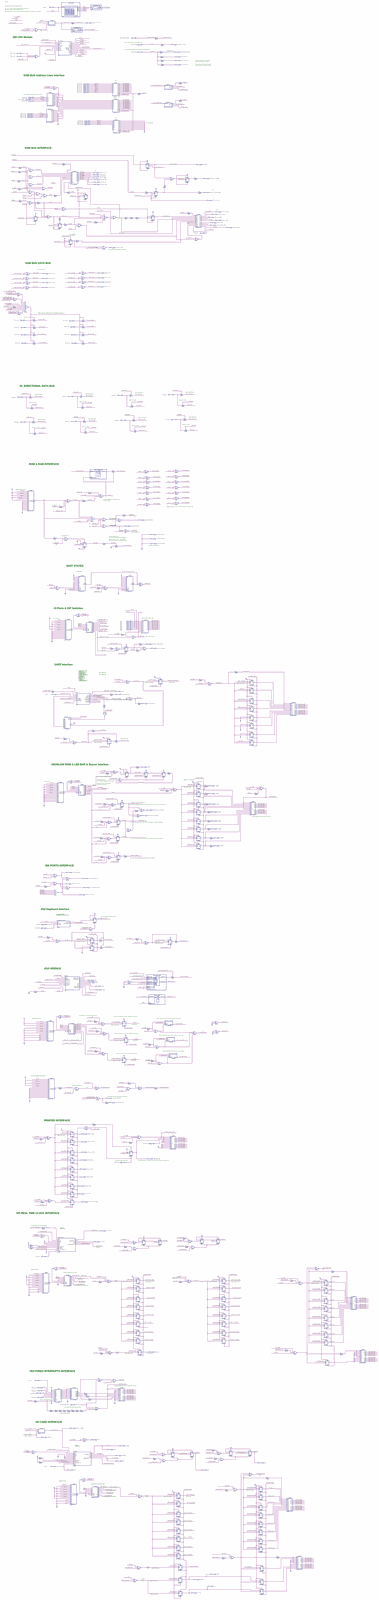
[diagram p0: schematic sheet, whole]
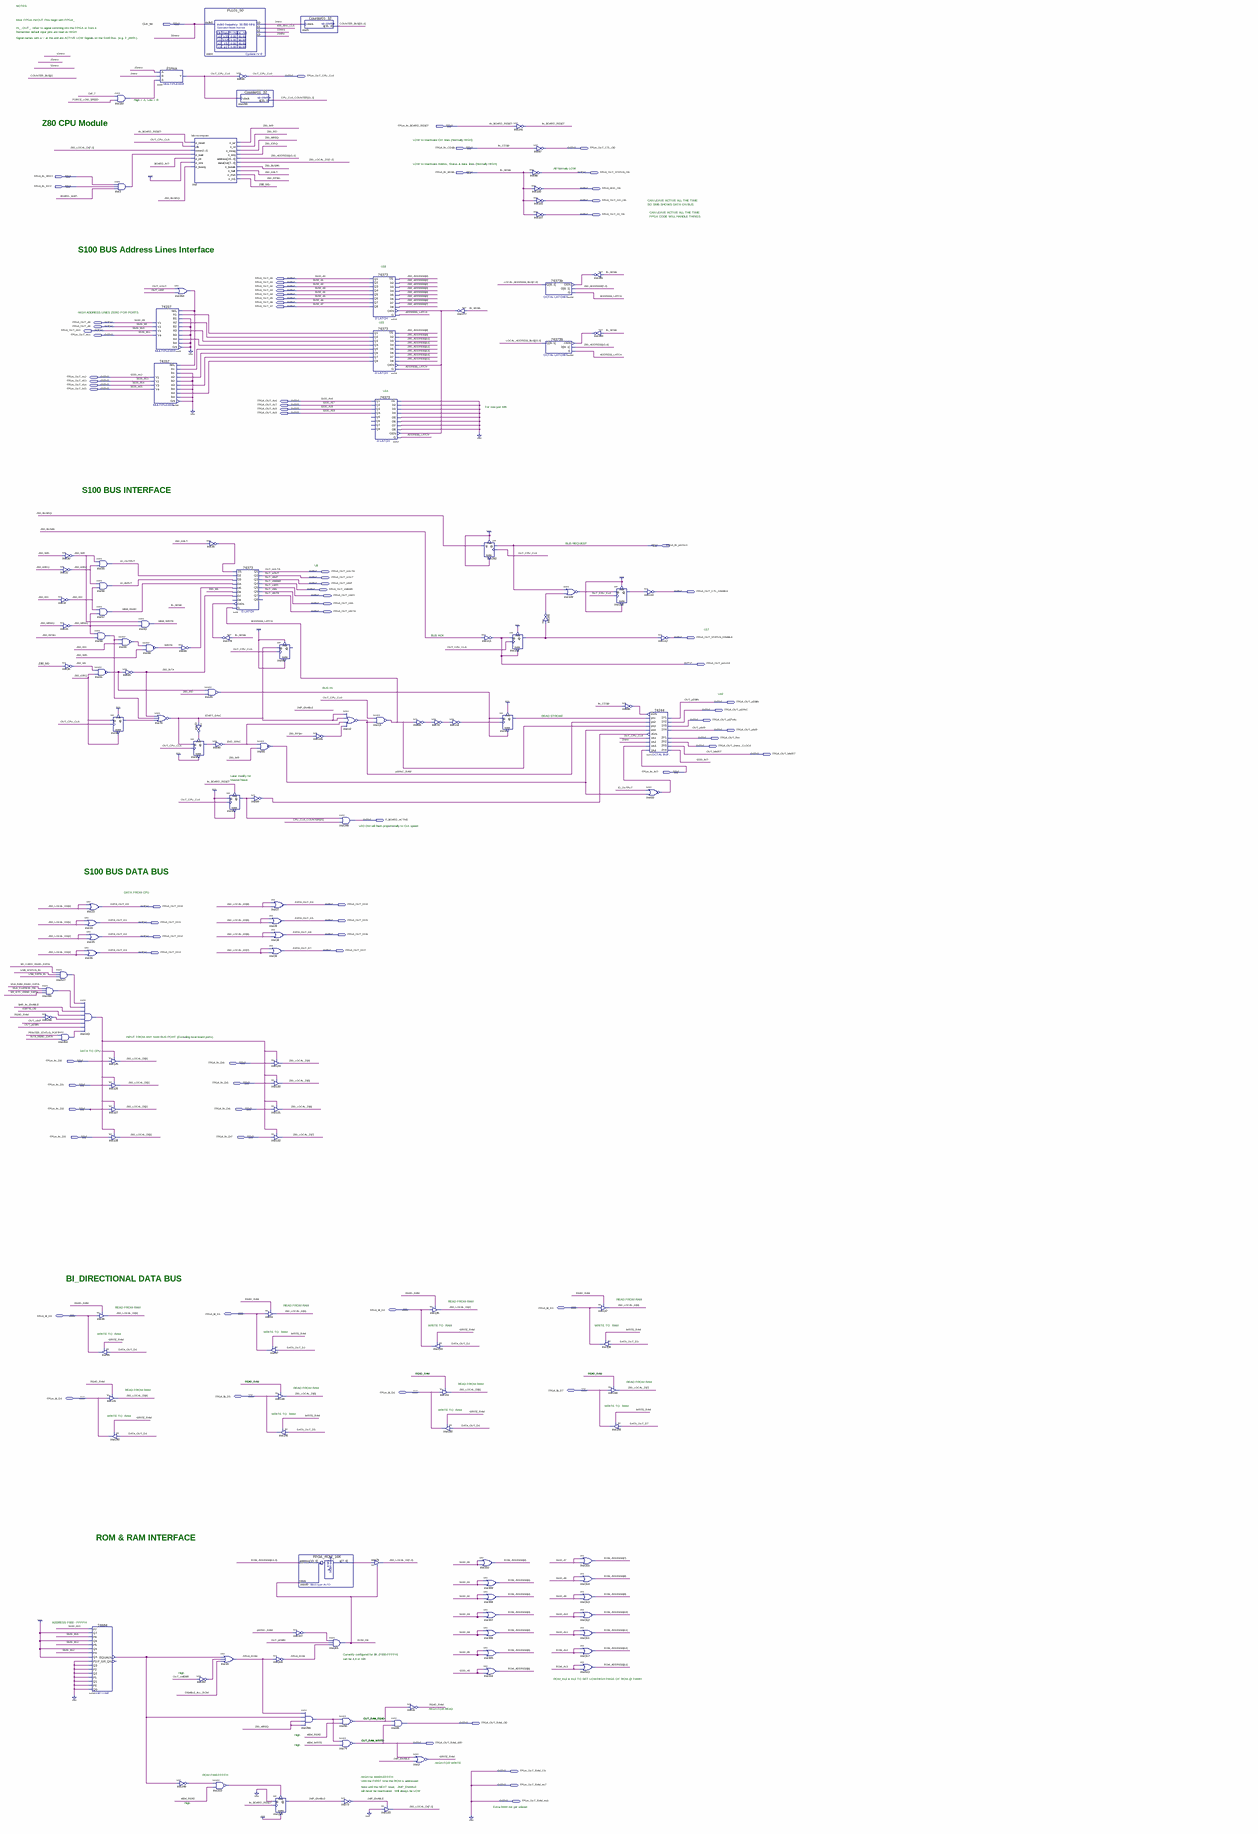
[diagram p1: schematic sheet, upper part]
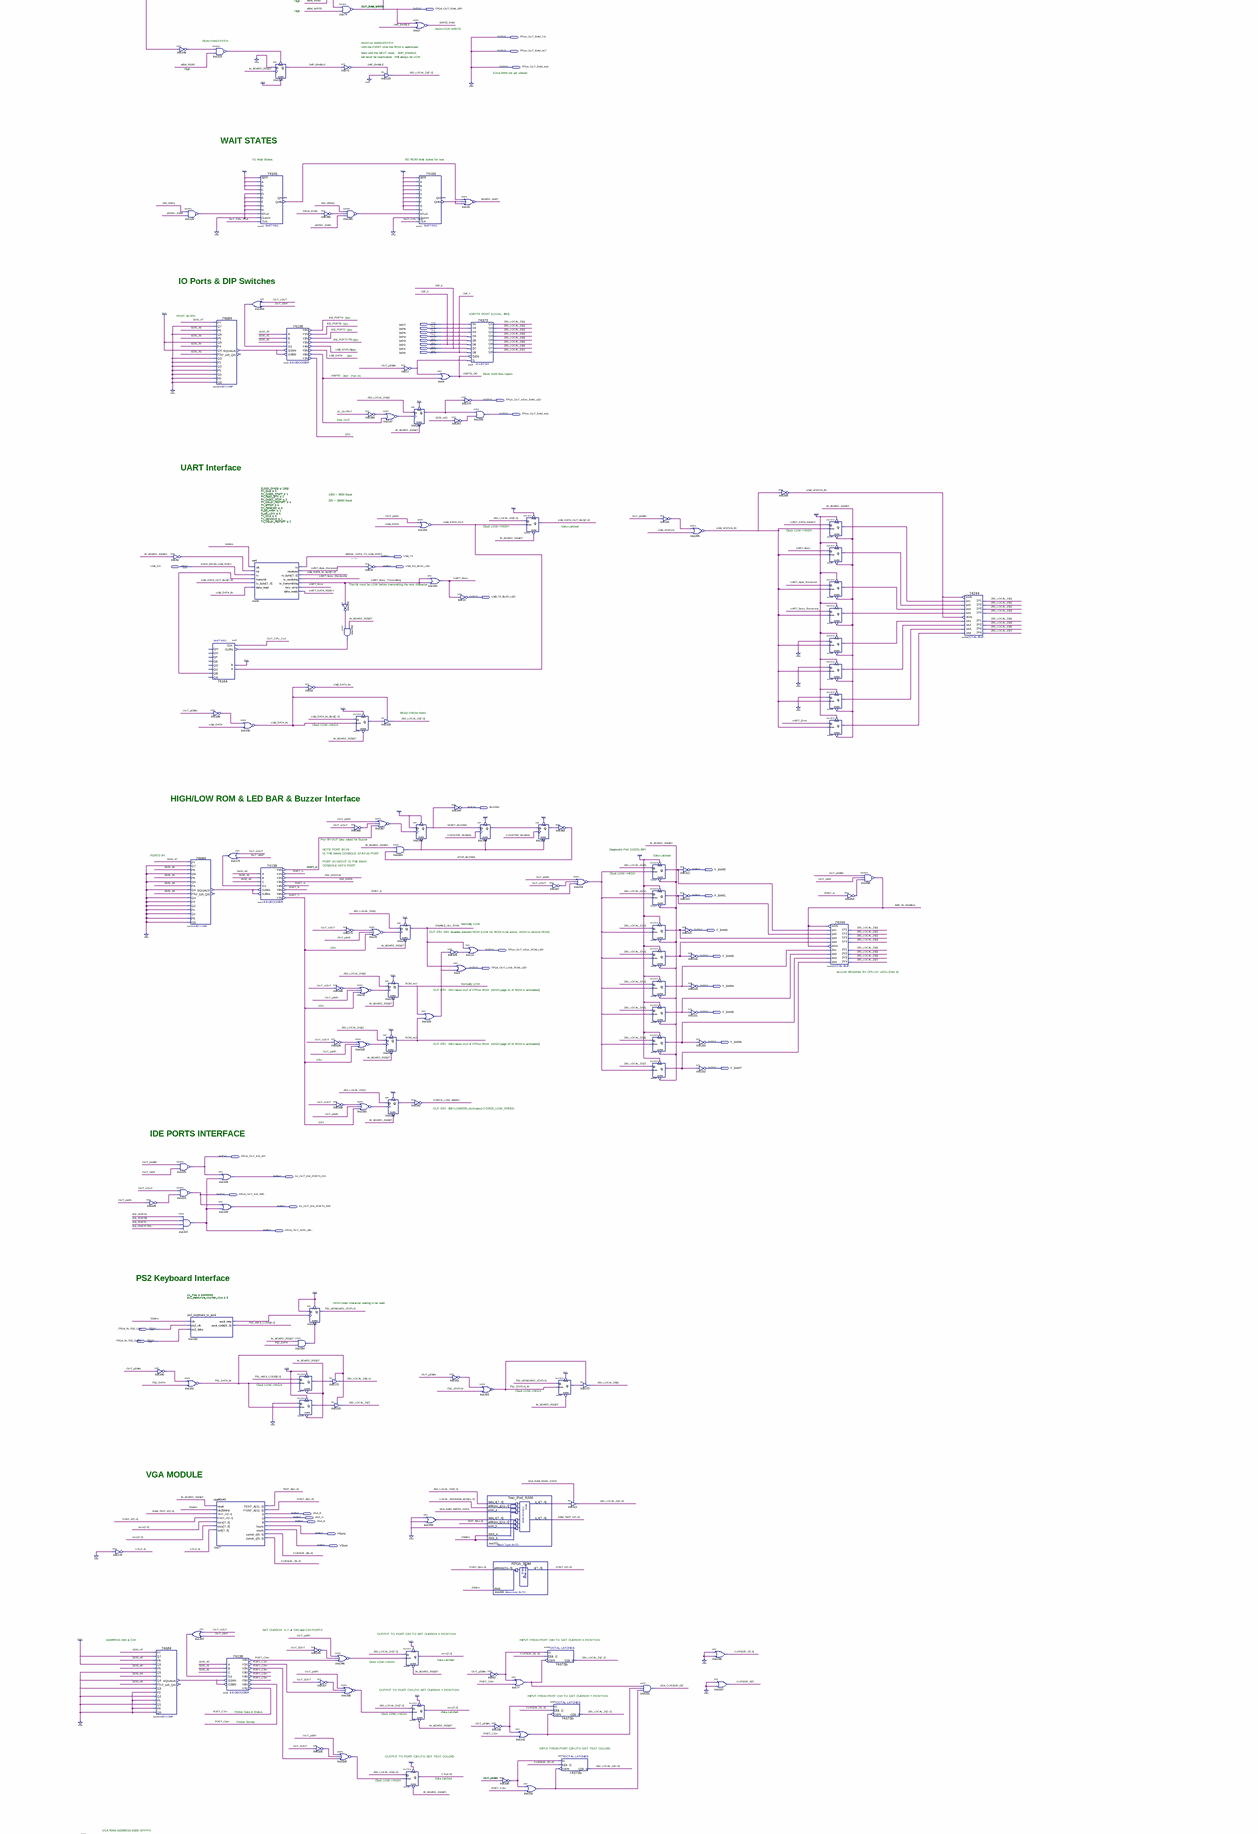
[diagram p2: schematic sheet, middle part]
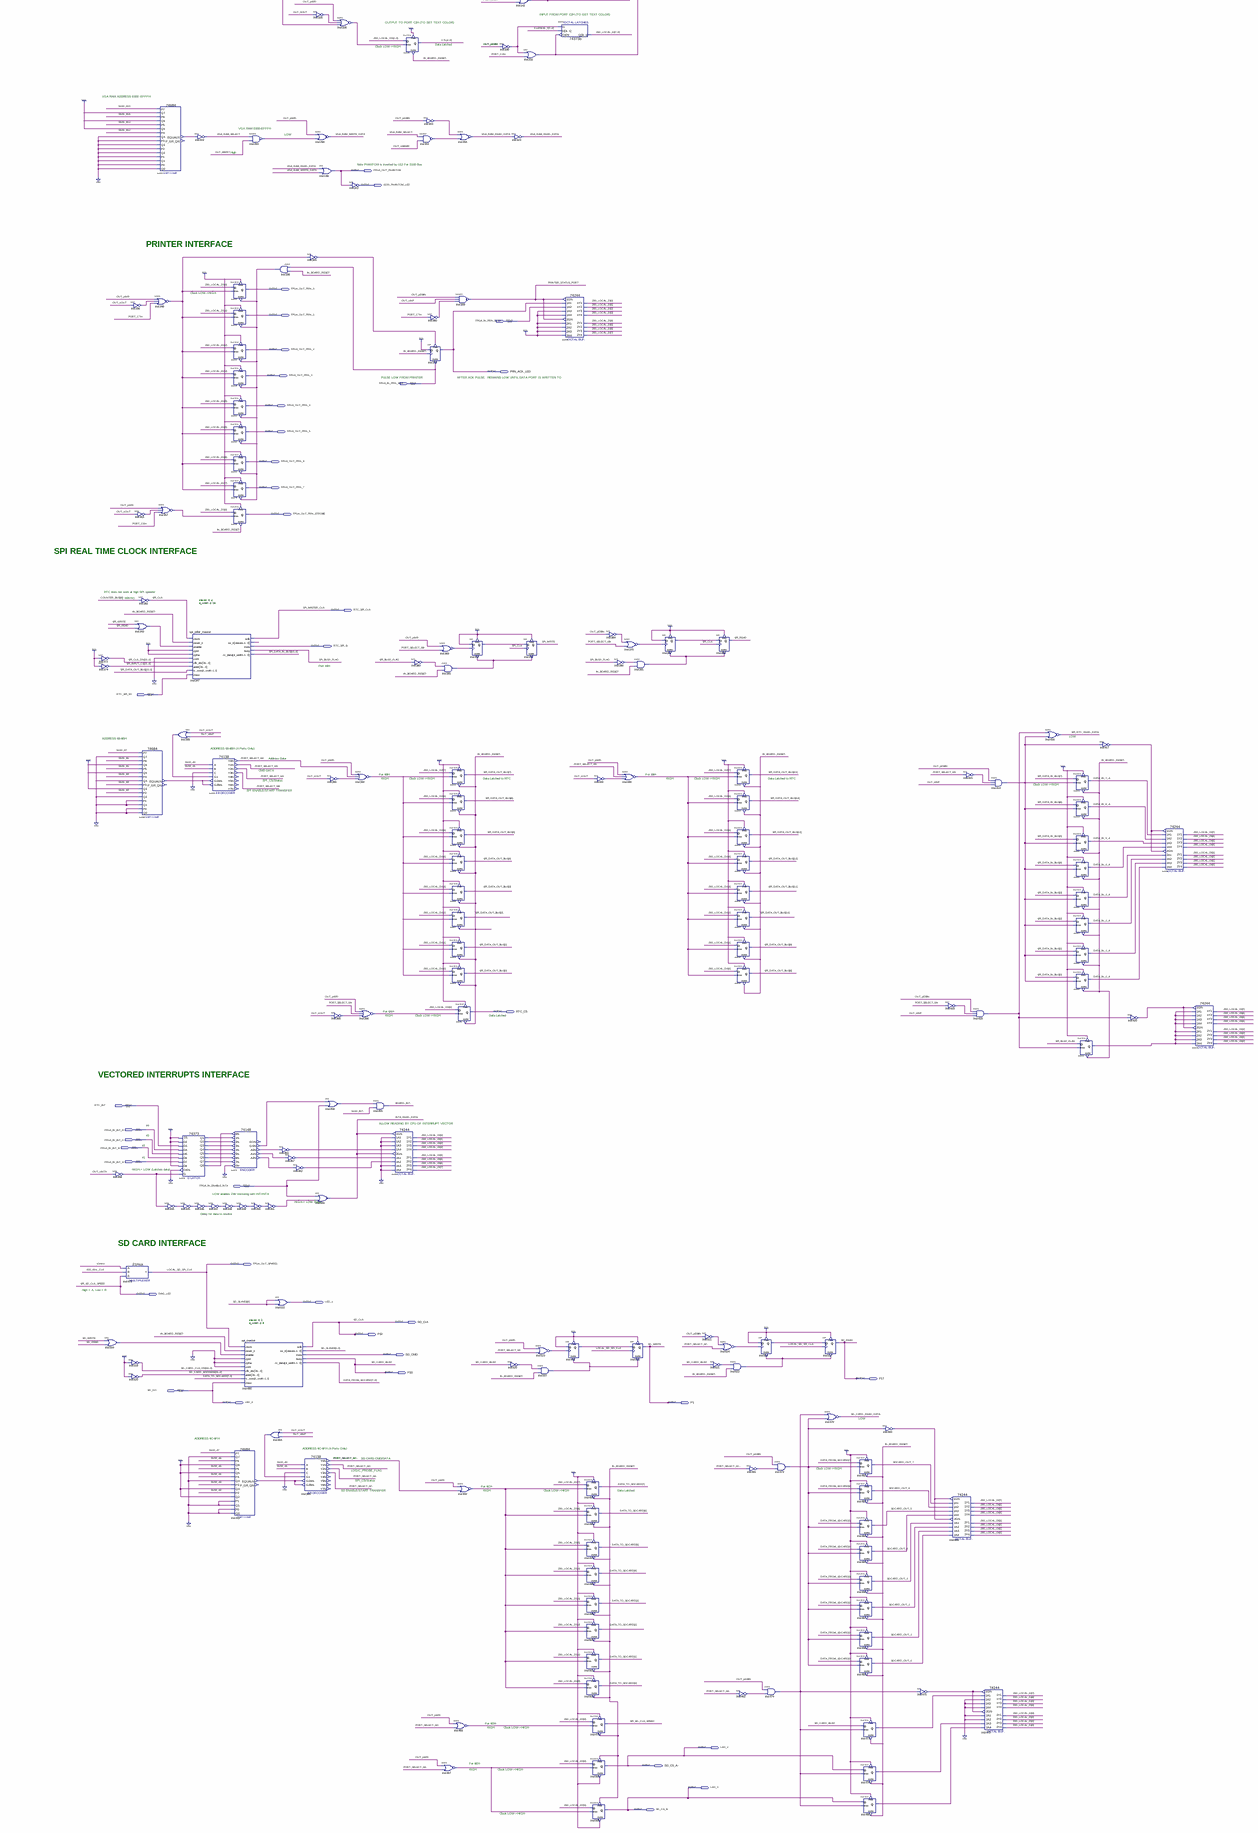
[diagram p3: schematic sheet, lower part]
// Quartus schematic Z80_FPGA.bdf as structural Verilog: 446 symbols, 157 pins
module Z80_FPGA (
  input  CLK_50,
  input  \FPGA_IN_BOARD_RESET- ,
  input  \FPGA_IN_CDSB- ,
  input  \FPGA_IN_SDSB- ,
  input  FPGA_IN_XRDY,
  input  FPGA_IN_RDY,
  input  \FPGA_IN_pHOLD- ,
  input  \FPGA_IN_INT- ,
  input  FPGA_IN_DI0,
  input  FPGA_IN_DI4,
  input  FPGA_IN_DI5,
  input  FPGA_IN_DI1,
  input  FPGA_IN_DI2,
  input  FPGA_IN_DI6,
  input  FPGA_IN_DI3,
  input  FPGA_IN_DI7,
  input  DIP7,
  input  DIP6,
  input  DIP5,
  input  DIP4,
  input  DIP3,
  input  DIP2,
  input  DIP1,
  input  DIP0,
  input  USB_RX,
  input  FPGA_IN_PS2_CLK,
  input  FPGA_IN_PS2_DATA,
  input  FPGA_IN_PRN_BUSY,
  input  FPGA_IN_PRN_ACK,
  input  RTC_SPI_SO,
  input  RTC_INT,
  input  \FPGA_IN_INT_D- ,
  input  \FPGA_IN_INT_C- ,
  input  \FPGA_IN_INT_B- ,
  input  \FPGA_IN_INT_A- ,
  input  FPGA_IN_ENABLE_INTA,
  input  SD_DO,
  inout  FPGA_BI_D3,
  inout  FPGA_BI_D2,
  inout  FPGA_BI_D1,
  inout  FPGA_BI_D0,
  inout  FPGA_BI_D7,
  inout  FPGA_BI_D6,
  inout  FPGA_BI_D5,
  inout  FPGA_BI_D4,
  output FPGA_OUT_CPU_CLK,
  output \FPGA_OUT_CTL_OE- ,
  output \FPGA_OUT_STATUS_OE- ,
  output \FPGA_ADD_OE- ,
  output \FPGA_OUT_DO_OE- ,
  output \FPGA_OUT_DI_OE- ,
  output FPGA_OUT_A0,
  output FPGA_OUT_A1,
  output FPGA_OUT_A2,
  output FPGA_OUT_A3,
  output FPGA_OUT_A4,
  output FPGA_OUT_A5,
  output FPGA_OUT_A6,
  output FPGA_OUT_A7,
  output FPGA_OUT_A8,
  output FPGA_OUT_A9,
  output FPGA_OUT_A10,
  output FPGA_OUT_A11,
  output FPGA_OUT_A12,
  output FPGA_OUT_A13,
  output FPGA_OUT_A14,
  output FPGA_OUT_A15,
  output FPGA_OUT_A16,
  output FPGA_OUT_A17,
  output FPGA_OUT_A18,
  output FPGA_OUT_A19,
  output FPGA_OUT_sHLTA,
  output FPGA_OUT_sOUT,
  output FPGA_OUT_sINP,
  output FPGA_OUT_sMEMR,
  output FPGA_OUT_CTL_DISABLE,
  output \FPGA_OUT_sWO- ,
  output FPGA_OUT_sM1,
  output FPGA_OUT_sINTA,
  output FPGA_OUT_STATUS_DISABLE,
  output FPGA_OUT_pHLDA,
  output FPGA_OUT_pDBIN,
  output FPGA_OUT_pSYNC,
  output \FPGA_OUT_pSTVAL- ,
  output \FPGA_OUT_pWR- ,
  output FPGA_OUT_PHI,
  output FPGA_OUT_2mHz_CLOCK,
  output FPGA_OUT_MWRT,
  output \F_BOARD_ACTIVE- ,
  output FPGA_OUT_DO4,
  output FPGA_OUT_DO0,
  output FPGA_OUT_DO5,
  output FPGA_OUT_DO1,
  output FPGA_OUT_DO6,
  output FPGA_OUT_DO2,
  output FPGA_OUT_DO7,
  output FPGA_OUT_DO3,
  output \FPGA_OUT_RAM_OE- ,
  output \FPGA_OUT_RAM_WR- ,
  output \FPGA_OUT_RAM_CS- ,
  output FPGA_OUT_RAM_A17,
  output FPGA_OUT_RAM_A18,
  output \FPGA_OUT_HIGH_RAM_LED- ,
  output FPGA_OUT_RAM_A16,
  output USB_TX,
  output USB_RX_BUSY_LED,
  output USB_TX_BUSY_LED,
  output BUZZER,
  output F_BAR0,
  output F_BAR1,
  output F_BAR2,
  output \FPGA_OUT_HIGH_ROM_LED- ,
  output F_BAR3,
  output \FPGA_OUT_LOW_ROM_LED- ,
  output F_BAR4,
  output F_BAR5,
  output F_BAR6,
  output F_BAR7,
  output \FPGA_OUT_IDE_RD- ,
  output \5V_OUT_IDE_PORTS_RD- ,
  output \FPGA_OUT_IDE_WR- ,
  output \5V_OUT_IDE_PORTS_WR- ,
  output \FPGA_OUT_8255_SEL- ,
  output VGA_R,
  output VGA_G,
  output VGA_B,
  output HSync,
  output VSync,
  output FPGA_OUT_PHANTOM,
  output S100_PHANTOM_LED,
  output FPGA_OUT_PRN_0,
  output FPGA_OUT_PRN_1,
  output FPGA_OUT_PRN_2,
  output PRN_ACK_LED,
  output FPGA_OUT_PRN_3,
  output FPGA_OUT_PRN_4,
  output FPGA_OUT_PRN_5,
  output FPGA_OUT_PRN_6,
  output FPGA_OUT_PRN_7,
  output FPGA_OUT_PRN_STROBE,
  output RTC_SPI_CLK,
  output RTC_SPI_SI,
  output RTC_CS,
  output FPGA_OUT_SPARE1,
  output DIAG_LED,
  output LED_1,
  output SD_CLK,
  output P32,
  output SD_CMD,
  output P33,
  output P17,
  output LED_4,
  output P1,
  output LED_2,
  output \SD_CS_A- ,
  output LED_3,
  output \SD_CS_B- 
);

  wire \2mHz , \10mHz , \25Mhz , \400_KHz_CLK , ADDRESS_LATCH, \BAR_IN_ENABLE- , \BOARD_INT- , \BOARD_WAIT- ,
       DATA_IN_0_A, DATA_IN_1_A, DATA_IN_2_A, DATA_IN_3_A, DATA_IN_4_A, DATA_IN_5_A, DATA_IN_6_A,
       DATA_IN_7_A, DISABLE_ALL_ROM, END_SYNC, \FORCE_LOW_SPEED- , FPGA_ROM, \FPGA_ROM- , \IDE_PORTA- ,
       \IDE_PORTB- , \IDE_PORTC- , \IDE_PORTCTRL- , IN_BOARD_RESET, inst3_out, inst16_y7n, inst17_out,
       inst29_out, inst35_out, inst37_qb, inst42_out, inst43_out, inst49_out, inst58_out, inst60_out,
       inst61_out, inst62_out, inst69_out, inst72_out, inst77_out, inst78_out, inst81_out, inst83_out,
       inst84_out, inst85_out, inst86_out, inst92_q, inst93_q, inst95_q, inst97_q, inst102_q, inst103_qhn,
       inst106_out, inst108_q, inst109_out, inst116_q1, inst116_q2, inst116_q3, inst116_q4, inst116_q5,
       inst116_q6, inst116_q7, inst116_q8, inst118_out, inst120_out, inst121_qhn, inst138_equaln,
       inst142_out, inst147_out, inst149_equaln, inst152_out, inst153_out, inst160_out, inst162_ascii_new,
       inst163_out, inst165_out, inst166_out, inst167_out, inst175_out, inst176_equaln, inst177_out,
       inst178_out, inst182_q, inst183_q, inst184_q, inst185_q, inst186_q, inst187_out, inst188_q,
       inst189_out, inst191_out, inst194_q, inst195_q, inst196_q, inst197_q, inst198_q, inst199_q, inst200_q,
       inst201_q, inst204_out, inst207_out, inst208_q, inst209_q, inst218_out, inst223_out, inst226_out,
       inst232_out, inst235_equaln, inst236_out, inst245_out, inst246_out, inst248_out, inst254_out,
       inst257_out, inst258_out, inst264_out, inst266_q, inst267_out, inst273_out, inst281_out, inst283_out,
       inst284_out, inst285_out, inst286_out, inst288_out, inst289_out, inst291_out, inst297_out,
       inst298_out, inst299_out, inst300_out, inst302_out, inst303_out, inst321_equaln, inst326_out,
       inst327_out, inst328_out, inst329_out, inst330_out, inst336_q, inst338_out, inst339_q, inst340_out,
       inst343_out, inst348_out, inst349_q, inst351_q, inst352_out, inst356_out, inst357_out, inst358_q,
       inst360_out, inst363_out, inst364_out, inst365_out, inst367_out, inst368_out, inst369_out,
       inst370_out, inst375_a0n, inst375_a1n, inst375_a2n, inst375_gsn, inst376_q1, inst376_q2, inst376_q3,
       inst376_q4, inst376_q5, inst376_q6, inst376_q7, inst376_q8, inst377_q, inst380_out, inst381_out,
       inst384_out, inst386_equaln, inst387_q, inst390_out, inst391_out, inst392_out, inst395_out,
       inst396_out, inst398_out, inst399_out, inst411_q, inst412_equaln, inst414_out, inst415_out,
       inst417_out, inst418_out, inst419_out, inst420_out, inst430_out, inst440_out, inst441_out,
       inst444_out, inst445_out, inst446_out, inst447_out, inst448_out, inst449_out, inst450_out,
       inst451_out, inst453_out, inst454_out, inst456_out, inst457_out, inst458_out, inst462_out,
       inst464_out, inst465_out, inst467_out, inst468_q, inst471_q, inst473_out, inst474_out, inst475_out,
       inst476_q, inst480_q, inst491_out, inst492_out, inst493_out, inst504_out, inst507_out, inst511_out,
       inst512_q, inst521_out, inst522_out, inst523_out, inst524_out, inst525_out, inst526_out, inst527_out,
       inst528_out, inst529_out, \INTA_READ_DATA- , IO_INPUT, IO_OUTPUT, \IOBYTE- , \IOBYTE_OE- , JMP_ENABLE,
       \JMP_ENABLE- , MEM_READ, MEM_WRITE, OUT_CPU_CLK, \OUT_RAM_READ- , \PORT_0- , \PORT_1- , \PORT_4- ,
       \PORT_5- , \PORT_6- , \PORT_7- , \PORT_C0H- , \PORT_C1H- , \PORT_C2H- , \PORT_C3H- , \PORT_C4H- ,
       \PORT_C5H- , \PORT_C6H- , \PORT_C7H- , \PORT_SELECT_6A- , \PORT_SELECT_6B- , \PORT_SELECT_6C- ,
       \PORT_SELECT_6D- , \PORT_SELECT_6E- , \PORT_SELECT_6F- , \PORT_SELECT_68- , \PORT_SELECT_69- ,
       \PRINTER_STATUS_PORT- , \PS2_DATA- , PS2_DATA_IN, PS2_KEYBOARD_STATUS, \PS2_STATUS- , PS2_STATUS_IN,
       pSYNC_RAW, READ_RAM, ROM_A12, ROM_A13, ROM_OE, \S100_INT- , \SD_CARD_READ_DATA- , SDCARD_OUT_0,
       SDCARD_OUT_1, SDCARD_OUT_2, SDCARD_OUT_3, SDCARD_OUT_4, SDCARD_OUT_5, SDCARD_OUT_6, SDCARD_OUT_7,
       SPI_BUSY_FLAG, SPI_CLK, SPI_READ, \SPI_RTC_READ_DATA- , SPI_WRITE, START_BUZZER, START_SYNC,
       STOP_BUZZER, UART_Busy, UART_Busy_Recieving, UART_Busy_Transmitting, UART_Byte_Recieved,
       UART_DATA_READY, UART_Error, \USB_DATA- , USB_DATA_IN, \USB_DATA_IN- , USB_DATA_OUT, \USB_STATUS- ,
       USB_STATUS_IN, \USB_STATUS_IN- , \VGA_CURSOR_OE- , VGA_RAM_READ_DATA, \VGA_RAM_READ_DATA- ,
       VGA_RAM_SELECT, VGA_RAM_WRITE_DATA, WRITE, WRITE_RAM, \Z80_BUSAK- , \Z80_BUSRQ- , \Z80_HALT- ,
       Z80_INTA, Z80_IORQ, \Z80_IORQ- , Z80_M1, \Z80_M1- , Z80_MREQ, \Z80_MREQ- , Z80_RD, \Z80_RD- ,
       \Z80_RFSH- , Z80_WR, \Z80_WR- ;
  wire [1:0] SD_SLAVES;
  wire [3:0] inst347_ss_n;
  wire [6:0] inst277_q, PS2_ASCII_CODE;
  wire [7:0] CTL, CURSOR_X, CURSOR_Y, DATA_FROM_SDCARD, DATA_TO_SDCARD, FONT_D, inst44_q, inst170_q,
       inst259_out, inst271_q_a, ocrx, ocry, RAM_TEXT_D, USB_DATA_IN_BUS, USB_DATA_OUT_BUS, Z80_LOCAL_D0,
       Z80_LOCAL_DI;
  wire [11:0] FONT_A, TEXT_A;
  wire [13:0] ROM_ADDRESS;
  wire [15:0] LOCAL_ADDRESS_BUS, SPI_DATA_IN_BUS, SPI_DATA_OUT_BUS, Z80_ADDRESS;
  wire [31:0] COUNTER_BUS, CPU_CLK_COUNTER, SD_CARD_ADDRESS, SD_CARD_CLK_DIV, SPI_CLK_DIV, SPI_INPUT_CS;

  and inst430 (inst430_out, \VGA_RAM_READ_DATA- , \VGA_CURSOR_OE- , \SPI_RTC_READ_DATA- );
  not inst298 (inst298_out, READ_RAM);
  not inst32 (Z80_RD, \Z80_RD- );
  and inst527 (inst527_out, \SD_CARD_READ_DATA- , \USB_STATUS_IN- , \USB_DATA_IN- );
  and inst454 (inst454_out, \PRINTER_STATUS_PORT- , \INTA_READ_DATA- );
  not inst30 (Z80_WR, \Z80_WR- );
  not inst31 (Z80_IORQ, \Z80_IORQ- );
  not inst33 (Z80_MREQ, \Z80_MREQ- );
  not inst36 (Z80_M1, \Z80_M1- );
  or inst23 (FPGA_OUT_DO0, Z80_LOCAL_D0[0], Z80_LOCAL_D0[0]);
  or inst24 (FPGA_OUT_DO1, Z80_LOCAL_D0[1], Z80_LOCAL_D0[1]);
  or inst25 (FPGA_OUT_DO2, Z80_LOCAL_D0[2], Z80_LOCAL_D0[2]);
  or inst26 (FPGA_OUT_DO3, Z80_LOCAL_D0[3], Z80_LOCAL_D0[3]);
  and inst163 (inst163_out, inst527_out, inst430_out, \BAR_IN_ENABLE- , \IOBYTE_OE- , inst298_out, FPGA_OUT_sINP, FPGA_OUT_pDBIN, inst454_out);
  \74684  inst149 (
    .P2(1'b0), .Q2(1'b0), .P1(1'b0), .Q1(1'b0), .P0(1'b0), .Q0(1'b0), .P7(FPGA_OUT_A15), .Q7(1'b1),
    .Q6(1'b1), .P6(FPGA_OUT_A14), .Q5(1'b1), .P5(FPGA_OUT_A13), .P4(FPGA_OUT_A12), .Q4(1'b1), .Q3(1'b0),
    .P3(1'b0), .EQUALN(inst149_equaln));  // open: P_GR_QN
  and inst55 (IO_OUTPUT, Z80_WR, Z80_IORQ);
  and inst56 (IO_INPUT, Z80_IORQ, Z80_RD);
  and inst57 (MEM_READ, Z80_RD, Z80_MREQ);
  and inst58 (inst58_out, Z80_MREQ, \Z80_RFSH- );
  nand inst61 (inst61_out, Z80_M1, Z80_IORQ);
  TRI inst46 (.IN(FPGA_BI_D0), .OE(READ_RAM), .OUT(Z80_LOCAL_DI[0]));
  TRI inst45 (.IN(FPGA_OUT_DO0), .OE(WRITE_RAM), .OUT(FPGA_BI_D0));
  TRI inst141 (.IN(FPGA_BI_D4), .OE(READ_RAM), .OUT(Z80_LOCAL_DI[4]));
  assign SPI_CLK_DIV = ~{32{1'b1}};  // NOT inst372, 32 bits wide
  assign SPI_INPUT_CS = ~{32{1'b1}};  // NOT inst374, 32 bits wide
  or inst504 (inst504_out, P1, P17);
  and inst167 (inst167_out, DIP0, \FORCE_LOW_SPEED- );
  and inst3 (inst3_out, FPGA_IN_XRDY, FPGA_IN_RDY, \BOARD_WAIT- );
  nand inst60 (inst60_out, inst58_out, \Z80_RD- );
  not inst65 (Z80_INTA, inst61_out);
  DFF inst92 (.CLRN(Z80_IORQ), .CLK(OUT_CPU_CLK), .D(Z80_IORQ), .PRN(1'b1), .Q(inst92_q));
  TRI inst125 (.IN(FPGA_IN_DI0), .OE(inst163_out), .OUT(Z80_LOCAL_DI[0]));
  TRI inst126 (.IN(FPGA_IN_DI1), .OE(inst163_out), .OUT(Z80_LOCAL_DI[1]));
  TRI inst127 (.IN(FPGA_IN_DI2), .OE(inst163_out), .OUT(Z80_LOCAL_DI[2]));
  TRI inst128 (.IN(FPGA_IN_DI3), .OE(inst163_out), .OUT(Z80_LOCAL_DI[3]));
  TRI inst140 (.IN(FPGA_OUT_DO4), .OE(WRITE_RAM), .OUT(FPGA_BI_D4));
  assign CTL[7:3] = ~{5{1'b0}};  // NOT inst179, 5 bits wide
  not inst456 (inst456_out, FPGA_OUT_sINTA);
  \21mux  inst479 (.S(DIAG_LED), .B(\400_KHz_CLK ), .A(\10mHz ), .Y(FPGA_OUT_SPARE1));
  and inst63 (MEM_WRITE, Z80_WR, Z80_MREQ);
  not inst356 (inst356_out, FPGA_OUT_sOUT);
  not inst363 (inst363_out, FPGA_OUT_sOUT);
  not inst382 (SPI_CLK, COUNTER_BUS[4]);
  or inst343 (inst343_out, SPI_WRITE, SPI_READ);
  \74684  inst386 (
    .P2(FPGA_OUT_A2), .Q2(1'b0), .P1(1'b0), .Q1(1'b0), .P0(1'b0), .Q0(1'b0), .P7(FPGA_OUT_A7), .Q7(1'b0),
    .Q6(1'b1), .P6(FPGA_OUT_A6), .Q5(1'b1), .P5(FPGA_OUT_A5), .P4(FPGA_OUT_A4), .Q4(1'b0), .Q3(1'b1),
    .P3(FPGA_OUT_A3), .EQUALN(inst386_equaln));  // open: P_GR_QN
  assign SD_CARD_CLK_DIV = ~{32{1'b1}};  // NOT inst518, 32 bits wide
  assign SD_CARD_ADDRESS = ~{32{1'b1}};  // NOT inst520, 32 bits wide
  \74157  inst53 (
    .A1(inst116_q1), .B1(1'b0), .SEL(inst264_out), .B2(1'b0), .A3(inst116_q3), .B3(1'b0), .A2(inst116_q2),
    .B4(1'b0), .GN(1'b0), .A4(inst116_q4), .Y2(FPGA_OUT_A9), .Y1(FPGA_OUT_A8), .Y4(FPGA_OUT_A11),
    .Y3(FPGA_OUT_A10));
  \74157  inst168 (
    .A1(inst116_q5), .B1(1'b0), .SEL(inst264_out), .B2(1'b0), .A3(inst116_q7), .B3(1'b0), .A2(inst116_q6),
    .B4(1'b0), .GN(1'b0), .A4(inst116_q8), .Y2(FPGA_OUT_A13), .Y1(FPGA_OUT_A12), .Y4(FPGA_OUT_A15),
    .Y3(FPGA_OUT_A14));
  nand inst68 (WRITE, inst60_out, \Z80_WR- );
  nor inst70 (START_SYNC, Z80_INTA, inst58_out, inst92_q);
  not inst226 (inst226_out, \FPGA_OUT_pWR- );
  not inst340 (inst340_out, FPGA_OUT_pDBIN);
  \74684  inst235 (
    .P2(1'b0), .Q2(1'b0), .P1(1'b0), .Q1(1'b0), .P0(1'b0), .Q0(1'b0), .P7(FPGA_OUT_A7), .Q7(1'b1), .Q6(1'b1),
    .P6(FPGA_OUT_A6), .Q5(1'b0), .P5(FPGA_OUT_A5), .P4(FPGA_OUT_A4), .Q4(1'b0), .Q3(1'b0), .P3(FPGA_OUT_A3),
    .EQUALN(inst235_equaln));  // open: P_GR_QN
  nor inst348 (inst348_out, \FPGA_OUT_pWR- , inst356_out, \PORT_C7H- );
  \21mux  inst287 (.S(inst167_out), .B(\2mHz ), .A(\25Mhz ), .Y(OUT_CPU_CLK));
  not inst49 (inst49_out, \FPGA_IN_BOARD_RESET- );
  \74684  inst321 (
    .P2(1'b0), .Q2(1'b0), .P1(1'b0), .Q1(1'b0), .P0(1'b0), .Q0(1'b0), .P7(FPGA_OUT_A15), .Q7(1'b1),
    .Q6(1'b1), .P6(FPGA_OUT_A14), .Q5(1'b1), .P5(FPGA_OUT_A13), .P4(FPGA_OUT_A12), .Q4(1'b0), .Q3(1'b0),
    .P3(1'b0), .EQUALN(inst321_equaln));  // open: P_GR_QN
  nor inst357 (inst357_out, \FPGA_OUT_pWR- , inst363_out, \PORT_C6H- );
  not inst444 (inst444_out, inst456_out);
  or inst264 (inst264_out, FPGA_OUT_sOUT, FPGA_OUT_sINP);
  not inst69 (inst69_out, WRITE);
  not inst248 (inst248_out, inst149_equaln);
  nand inst120 (inst120_out, Z80_IORQ, pSYNC_RAW);
  \74684  inst176 (
    .P2(1'b0), .Q2(1'b0), .P1(1'b0), .Q1(1'b0), .P0(1'b0), .Q0(1'b0), .P7(FPGA_OUT_A7), .Q7(1'b0), .Q6(1'b0),
    .P6(FPGA_OUT_A6), .Q5(1'b0), .P5(FPGA_OUT_A5), .P4(FPGA_OUT_A4), .Q4(1'b0), .Q3(1'b0), .P3(FPGA_OUT_A3),
    .EQUALN(inst176_equaln));  // open: P_GR_QN
  nand inst225 (\FPGA_OUT_IDE_RD- , FPGA_OUT_pDBIN, FPGA_OUT_sINP);
  nand inst224 (\FPGA_OUT_IDE_WR- , FPGA_OUT_sOUT, inst226_out);
  and inst227 (\FPGA_OUT_8255_SEL- , \IDE_PORTA- , \IDE_PORTB- , \IDE_PORTC- , \IDE_PORTCTRL- );
  ps2_keyboard_to_ascii #(.clk_freq(50000000), .ps2_debounce_counter_size(8)) inst162 (
    .clk(CLK_50), .ps2_clk(FPGA_IN_PS2_CLK), .ps2_data(FPGA_IN_PS2_DATA), .ascii_new(inst162_ascii_new),
    .ascii_code(PS2_ASCII_CODE));
  nor inst341 (PS2_DATA_IN, inst340_out, \PS2_DATA- );
  or inst395 (inst395_out, FPGA_OUT_sOUT, FPGA_OUT_sINP);
  \74373  inst376 (
    .D1(1'b1), .D3(RTC_INT), .D6(\FPGA_IN_INT_B- ), .D7(\FPGA_IN_INT_A- ), .D2(1'b1), .G(inst456_out),
    .D4(\FPGA_IN_INT_D- ), .D5(\FPGA_IN_INT_C- ), .D8(1'b1), .OEN(1'b0), .Q3(inst376_q3), .Q6(inst376_q6),
    .Q7(inst376_q7), .Q2(inst376_q2), .Q8(inst376_q8), .Q4(inst376_q4), .Q5(inst376_q5), .Q1(inst376_q1));
  not inst445 (inst445_out, inst444_out);
  Microcomputer inst (
    .n_reset(\FPGA_IN_BOARD_RESET- ), .clk(OUT_CPU_CLK), .dataIn(Z80_LOCAL_DI), .n_wait(inst3_out),
    .n_int(\BOARD_INT- ), .n_nmi(1'b1), .n_busrq(\Z80_BUSRQ- ), .n_wr(\Z80_WR- ), .n_rd(\Z80_RD- ),
    .n_mreq(\Z80_MREQ- ), .n_iorq(\Z80_IORQ- ), .address(Z80_ADDRESS), .dataOut(Z80_LOCAL_D0),
    .n_busak(\Z80_BUSAK- ), .n_halt(\Z80_HALT- ), .n_rfsh(\Z80_RFSH- ), .n_m1(\Z80_M1- ));
  not inst72 (inst72_out, START_SYNC);
  DFF inst95 (.CLRN(1'b1), .CLK(OUT_CPU_CLK), .D(START_SYNC), .PRN(inst72_out), .Q(inst95_q));
  not inst297 (inst297_out, FPGA_OUT_sMEMR);
  or inst207 (inst207_out, FPGA_OUT_sOUT, FPGA_OUT_sINP);
  not inst319 (VGA_RAM_SELECT, inst321_equaln);
  spi_16bit_master #(.slaves(4), .d_width(16)) inst347 (
    .clock(SPI_CLK), .reset_n(\FPGA_IN_BOARD_RESET- ), .enable(inst343_out), .cpol(1'b1), .cpha(1'b1),
    .cont(1'b0), .clk_div(SPI_CLK_DIV), .addr(SPI_INPUT_CS), .tx_data(SPI_DATA_OUT_BUS), .miso(RTC_SPI_SO),
    .sclk(RTC_SPI_CLK), .ss_n(inst347_ss_n), .mosi(RTC_SPI_SI), .busy(SPI_BUSY_FLAG),
    .rx_data(SPI_DATA_IN_BUS));
  not inst446 (inst446_out, inst445_out);
  PLL01_50 inst4 (.inclk0(CLK_50), .c0(\2mHz ), .c1(\400_KHz_CLK ), .c2(\10mHz ), .c3(\25Mhz ));
  not inst35 (inst35_out, \Z80_HALT- );
  nand inst29 (inst29_out, inst61_out, \Z80_RD- );
  not inst80 (END_SYNC, inst95_q);
  nand inst223 (inst223_out, inst248_out, MEM_READ);
  \74684  inst138 (
    .P2(1'b0), .Q2(1'b0), .P1(1'b0), .Q1(1'b0), .P0(1'b0), .Q0(1'b0), .P7(FPGA_OUT_A7), .Q7(1'b0), .Q6(1'b0),
    .P6(FPGA_OUT_A6), .Q5(1'b1), .P5(FPGA_OUT_A5), .P4(FPGA_OUT_A4), .Q4(1'b1), .Q3(1'b0), .P3(FPGA_OUT_A3),
    .EQUALN(inst138_equaln));  // open: P_GR_QN
  \74164  inst37 (
    .CLRN(inst153_out), .CLK(OUT_CPU_CLK), .B(1'b1), .A(USB_DATA_OUT), .QB(inst37_qb));  // open: QD, QC, QA, QF, QH, QG, QE
  not inst189 (inst189_out, FPGA_OUT_pDBIN);
  or inst228 (\5V_OUT_IDE_PORTS_RD- , \FPGA_OUT_IDE_RD- , \FPGA_OUT_8255_SEL- );
  or inst229 (\5V_OUT_IDE_PORTS_WR- , \FPGA_OUT_IDE_WR- , \FPGA_OUT_8255_SEL- );
  vga80x40 inst7 (
    .reset(IN_BOARD_RESET), .clk25MHz(\25Mhz ), .TEXT_D(RAM_TEXT_D), .FONT_D(FONT_D), .ocrx(ocrx),
    .ocry(ocry), .octl(CTL), .TEXT_A(TEXT_A), .FONT_A(FONT_A), .R(VGA_R), .G(VGA_G), .B(VGA_B),
    .hsync(HSync), .vsync(VSync), .cursor_x(CURSOR_X[6:0]), .cursor_y(CURSOR_Y[5:0]));
  \74138  inst333 (
    .A(FPGA_OUT_A0), .B(FPGA_OUT_A1), .G1(inst395_out), .C(1'b0), .G2AN(inst386_equaln),
    .G2BN(inst386_equaln), .Y0N(\PORT_SELECT_68- ), .Y1N(\PORT_SELECT_69- ), .Y2N(\PORT_SELECT_6A- ),
    .Y3N(\PORT_SELECT_6B- ));  // open: Y4N, Y5N, Y6N, Y7N
  not inst447 (inst447_out, inst446_out);
  \74373  inst59 (
    .D1(inst35_out), .D3(IO_INPUT), .D6(Z80_M1), .D7(Z80_INTA), .D2(IO_OUTPUT), .G(ADDRESS_LATCH),
    .D4(MEM_READ), .D5(inst69_out), .OEN(inst178_out), .Q3(FPGA_OUT_sINP), .Q6(FPGA_OUT_sM1),
    .Q7(FPGA_OUT_sINTA), .Q2(FPGA_OUT_sOUT), .Q4(FPGA_OUT_sMEMR), .Q5(\FPGA_OUT_sWO- ), .Q1(FPGA_OUT_sHLTA));  // open: D8, Q8
  not inst178 (inst178_out, \FPGA_IN_SDSB- );
  DFF inst93 (.CLRN(1'b1), .CLK(OUT_CPU_CLK), .D(1'b1), .PRN(\FPGA_IN_BOARD_RESET- ), .Q(inst93_q));
  or inst34 (\FPGA_ROM- , inst149_equaln, inst297_out, DISABLE_ALL_ROM);
  or inst175 (inst175_out, FPGA_OUT_sOUT, FPGA_OUT_sINP);
  \74138  inst48 (
    .A(FPGA_OUT_A0), .B(FPGA_OUT_A1), .G1(inst207_out), .C(FPGA_OUT_A2), .G2AN(inst235_equaln),
    .G2BN(inst235_equaln), .Y0N(\PORT_C0H- ), .Y1N(\PORT_C1H- ), .Y2N(\PORT_C2H- ), .Y3N(\PORT_C3H- ),
    .Y4N(\PORT_C4H- ), .Y5N(\PORT_C5H- ), .Y6N(\PORT_C6H- ), .Y7N(\PORT_C7H- ));
  DLATCH inst231 (.CLRN(inst166_out), .D(Z80_LOCAL_D0[0]), .ENA(inst348_out), .PRN(1'b1), .Q(FPGA_OUT_PRN_0));
  DLATCH inst233 (.CLRN(inst166_out), .D(Z80_LOCAL_D0[1]), .ENA(inst348_out), .PRN(1'b1), .Q(FPGA_OUT_PRN_1));
  DLATCH inst234 (.CLRN(inst166_out), .D(Z80_LOCAL_D0[2]), .ENA(inst348_out), .PRN(1'b1), .Q(FPGA_OUT_PRN_2));
  DLATCH inst249 (.CLRN(inst166_out), .D(Z80_LOCAL_D0[3]), .ENA(inst348_out), .PRN(1'b1), .Q(FPGA_OUT_PRN_3));
  DLATCH inst251 (.CLRN(inst166_out), .D(Z80_LOCAL_D0[4]), .ENA(inst348_out), .PRN(1'b1), .Q(FPGA_OUT_PRN_4));
  DLATCH inst262 (.CLRN(inst166_out), .D(Z80_LOCAL_D0[5]), .ENA(inst348_out), .PRN(1'b1), .Q(FPGA_OUT_PRN_5));
  DLATCH inst276 (.CLRN(inst166_out), .D(Z80_LOCAL_D0[6]), .ENA(inst348_out), .PRN(1'b1), .Q(FPGA_OUT_PRN_6));
  DLATCH inst279 (.CLRN(inst166_out), .D(Z80_LOCAL_D0[7]), .ENA(inst348_out), .PRN(1'b1), .Q(FPGA_OUT_PRN_7));
  DLATCH inst334 (
    .CLRN(\FPGA_IN_BOARD_RESET- ), .D(Z80_LOCAL_D0[0]), .ENA(inst357_out), .PRN(1'b1), .Q(FPGA_OUT_PRN_STROBE));
  \74148  inst375 (
    .\5N (inst376_q5), .\0N (inst376_q8), .\1N (inst376_q1), .\2N (inst376_q2), .\3N (inst376_q3),
    .\4N (inst376_q4), .EIN(1'b0), .\6N (inst376_q6), .\7N (inst376_q7), .A1N(inst375_a1n),
    .A0N(inst375_a0n), .A2N(inst375_a2n), .GSN(inst375_gsn));  // open: EON
  not inst448 (inst448_out, inst447_out);
  \74684  inst412 (
    .P2(FPGA_OUT_A2), .Q2(1'b1), .P1(1'b0), .Q1(1'b0), .P0(1'b0), .Q0(1'b0), .P7(FPGA_OUT_A7), .Q7(1'b0),
    .Q6(1'b1), .P6(FPGA_OUT_A6), .Q5(1'b1), .P5(FPGA_OUT_A5), .P4(FPGA_OUT_A4), .Q4(1'b0), .Q3(1'b1),
    .P3(FPGA_OUT_A3), .EQUALN(inst412_equaln));  // open: P_GR_QN
  not inst66 (FPGA_OUT_CPU_CLK, OUT_CPU_CLK);
  Counter01_32 inst250 (.clock(OUT_CPU_CLK), .q(CPU_CLK_COUNTER));
  not inst84 (inst84_out, inst93_q);
  or inst204 (inst204_out, FPGA_OUT_sOUT, FPGA_OUT_sINP);
  uart #(.CLOCK_DIVIDE(1303), .RX_IDLE(0), .RX_CHECK_START(1), .RX_READ_BITS(2), .RX_CHECK_STOP(3), .RX_DELAY_RESTART(4), .RX_ERROR(5), .RX_RECEIVED(6), .FLAG_HIGH(1), .FLAG_LOW(0), .TX_IDLE(0), .TX_SENDING(1), .TX_DELAY_RESTART(2)) inst8 (
    .clk(CLK_50), .rst(inst49_out), .rx(USB_RX), .transmit(inst37_qb), .tx_byte(USB_DATA_OUT_BUS),
    .data_read(USB_DATA_IN), .tx(USB_TX), .received(UART_Byte_Recieved), .rx_byte(USB_DATA_IN_BUS),
    .is_receiving(UART_Busy_Recieving), .is_transmitting(UART_Busy_Transmitting), .recv_error(UART_Error),
    .data_ready(UART_DATA_READY));
  nor inst190 (USB_DATA_IN, inst189_out, \USB_DATA- );
  nand inst284 (inst284_out, VGA_RAM_SELECT, FPGA_OUT_MWRT);
  not inst449 (inst449_out, inst448_out);
  not inst450 (inst450_out, inst449_out);
  spi_master #(.slaves(2), .d_width(8)) inst490 (
    .clock(FPGA_OUT_SPARE1), .reset_n(\FPGA_IN_BOARD_RESET- ), .enable(inst504_out), .cpol(1'b0),
    .cpha(1'b0), .cont(1'b0), .clk_div(SD_CARD_CLK_DIV), .addr(SD_CARD_ADDRESS), .tx_data(DATA_TO_SDCARD),
    .miso(SD_DO), .sclk(P32), .ss_n(SD_SLAVES), .mosi(SD_CMD), .busy(P33), .rx_data(DATA_FROM_SDCARD));
  nand inst81 (inst81_out, END_SYNC, Z80_WR);
  TRI inst51 (.IN(FPGA_BI_D1), .OE(READ_RAM), .OUT(Z80_LOCAL_DI[1]));
  TRI inst47 (.IN(FPGA_OUT_DO1), .OE(WRITE_RAM), .OUT(FPGA_BI_D1));
  \74165  inst103 (
    .D(1'b0), .C(1'b1), .B(1'b1), .G(1'b0), .H(1'b0), .A(1'b1), .CLKIH(1'b0), .E(1'b0), .F(1'b0),
    .CLK(FPGA_OUT_CPU_CLK), .STLD(inst120_out), .SER(1'b1), .QHN(inst103_qhn));  // open: QH
  \74138  inst217 (
    .A(FPGA_OUT_A0), .B(FPGA_OUT_A1), .G1(inst175_out), .C(FPGA_OUT_A2), .G2AN(inst176_equaln),
    .G2BN(inst176_equaln), .Y0N(\PORT_0- ), .Y1N(\PORT_1- ), .Y2N(\PS2_STATUS- ), .Y3N(\PS2_DATA- ),
    .Y4N(\PORT_4- ), .Y5N(\PORT_5- ), .Y6N(\PORT_6- ), .Y7N(\PORT_7- ));
  not inst451 (inst451_out, inst450_out);
  or inst464 (inst464_out, FPGA_OUT_sOUT, FPGA_OUT_sINP);
  DFF inst98 (.CLRN(1'b1), .CLK(FPGA_OUT_CPU_CLK), .D(START_SYNC), .PRN(1'b1));  // open: Q
  or inst27 (FPGA_OUT_DO4, Z80_LOCAL_D0[4], Z80_LOCAL_D0[4]);
  or inst28 (FPGA_OUT_DO5, Z80_LOCAL_D0[5], Z80_LOCAL_D0[5]);
  or inst38 (FPGA_OUT_DO6, Z80_LOCAL_D0[6], Z80_LOCAL_D0[6]);
  or inst39 (FPGA_OUT_DO7, Z80_LOCAL_D0[7], Z80_LOCAL_D0[7]);
  TRI inst129 (.IN(FPGA_IN_DI4), .OE(inst163_out), .OUT(Z80_LOCAL_DI[4]));
  TRI inst130 (.IN(FPGA_IN_DI5), .OE(inst163_out), .OUT(Z80_LOCAL_DI[5]));
  TRI inst131 (.IN(FPGA_IN_DI6), .OE(inst163_out), .OUT(Z80_LOCAL_DI[6]));
  TRI inst132 (.IN(FPGA_IN_DI7), .OE(inst163_out), .OUT(Z80_LOCAL_DI[7]));
  TRI inst146 (.IN(FPGA_BI_D5), .OE(READ_RAM), .OUT(Z80_LOCAL_DI[5]));
  TRI inst145 (.IN(FPGA_OUT_DO5), .OE(WRITE_RAM), .OUT(FPGA_BI_D5));
  not inst318 (FPGA_ROM, \FPGA_ROM- );
  DFF inst124 (.CLRN(1'b1), .CLK(\FPGA_IN_BOARD_RESET- ), .D(1'b0), .PRN(inst223_out), .Q(\JMP_ENABLE- ));
  \74138  inst16 (
    .A(FPGA_OUT_A0), .B(FPGA_OUT_A1), .G1(inst204_out), .C(FPGA_OUT_A2), .G2AN(inst138_equaln),
    .G2BN(inst138_equaln), .Y0N(\IDE_PORTA- ), .Y1N(\IDE_PORTB- ), .Y2N(\IDE_PORTC- ), .Y3N(\IDE_PORTCTRL- ),
    .Y4N(\USB_STATUS- ), .Y5N(\USB_DATA- ), .Y6N(\IOBYTE- ), .Y7N(inst16_y7n));
  and inst166 (inst166_out, FPGA_IN_PRN_ACK, \FPGA_IN_BOARD_RESET- );
  not inst453 (inst453_out, inst375_a0n);
  or inst510 (LED_1, SD_SLAVES[0], SD_SLAVES[0]);
  FPGA_ROM_16K inst44 (.address(ROM_ADDRESS), .clock(ROM_OE), .q(inst44_q));
  not inst327 (inst327_out, pSYNC_RAW);
  and inst160 (inst160_out, \FPGA_IN_BOARD_RESET- , \PS2_DATA- );
  DLATCH inst277[6:0] (.CLRN(\FPGA_IN_BOARD_RESET- ), .D(PS2_ASCII_CODE), .ENA(PS2_DATA_IN), .PRN(1'b1), .Q(inst277_q));
  DLATCH inst339 (.CLRN(\FPGA_IN_BOARD_RESET- ), .D(1'b0), .ENA(PS2_DATA_IN), .PRN(1'b1), .Q(inst339_q));
  not inst457 (inst457_out, inst375_a1n);
  not inst462 (inst462_out, inst375_a2n);
  Counter01_32 inst5 (.clock(\2mHz ), .q(COUNTER_BUS));
  not inst106 (inst106_out, \Z80_RFSH- );
  and inst299 (inst299_out, \FPGA_ROM- , inst149_equaln, Z80_MREQ, Z80_MREQ);
  not inst52 (\USB_DATA_IN- , USB_DATA_IN);
  DFF inst295 (.CLRN(inst160_out), .CLK(inst162_ascii_new), .D(1'b1), .PRN(1'b1), .Q(PS2_KEYBOARD_STATUS));
  not inst245 (inst245_out, FPGA_OUT_sOUT);
  not inst326 (inst326_out, FPGA_OUT_sOUT);
  nor inst290 (VGA_RAM_WRITE_DATA, \FPGA_OUT_pWR- , inst284_out);
  not inst365 (inst365_out, inst348_out);
  or inst459 (\INTA_READ_DATA- , FPGA_IN_ENABLE_INTA, inst451_out);
  \74138  inst385 (
    .A(FPGA_OUT_A0), .B(FPGA_OUT_A1), .G1(inst464_out), .C(1'b0), .G2AN(inst412_equaln),
    .G2BN(inst412_equaln), .Y0N(\PORT_SELECT_6C- ), .Y1N(\PORT_SELECT_6D- ), .Y2N(\PORT_SELECT_6E- ),
    .Y3N(\PORT_SELECT_6F- ));  // open: Y4N, Y5N, Y6N, Y7N
  and inst301 (ROM_OE, inst327_out, FPGA_OUT_pDBIN, FPGA_ROM);
  not inst286 (inst286_out, \FPGA_ROM- );
  not inst526 (inst526_out, FPGA_OUT_sOUT);
  TRI inst173[6:0] (.IN(inst277_q), .OE(PS2_DATA_IN), .OUT(Z80_LOCAL_DI[6:0]));
  TRI inst210 (.IN(inst339_q), .OE(PS2_DATA_IN), .OUT(Z80_LOCAL_DI[7]));
  not inst257 (inst257_out, FPGA_OUT_sOUT);
  or inst148 (FPGA_OUT_PHANTOM, VGA_RAM_READ_DATA, VGA_RAM_WRITE_DATA);
  not inst396 (inst396_out, FPGA_OUT_sOUT);
  not inst399 (inst399_out, FPGA_OUT_sOUT);
  or inst458 (inst458_out, inst375_gsn, FPGA_IN_ENABLE_INTA);
  nor inst10 (pSYNC_RAW, START_SYNC, START_SYNC, END_SYNC, inst106_out);
  and inst346 (\F_BOARD_ACTIVE- , inst93_q, CPU_CLK_COUNTER[20]);
  nand inst50 (\OUT_RAM_READ- , inst299_out, MEM_READ);
  nand inst74 (\FPGA_OUT_RAM_WR- , inst299_out, MEM_WRITE);
  not inst73 (JMP_ENABLE, \JMP_ENABLE- );
  nand inst285 (inst285_out, Z80_MREQ, inst286_out, pSYNC_RAW);
  not inst152 (inst152_out, UART_Busy_Transmitting);
  and inst153 (inst153_out, inst152_out, \FPGA_IN_BOARD_RESET- );
  not inst273 (inst273_out, FPGA_OUT_sOUT);
  not inst288 (inst288_out, FPGA_OUT_sOUT);
  not inst338 (inst338_out, FPGA_OUT_sOUT);
  nor inst246 (inst246_out, \FPGA_OUT_pWR- , inst245_out, \PORT_C0H- );
  nor inst258 (inst258_out, \FPGA_OUT_pWR- , inst257_out, \PORT_C1H- );
  nor inst328 (inst328_out, \FPGA_OUT_pWR- , inst326_out, \PORT_C2H- );
  DLATCH inst170[7:0] (
    .CLRN(\FPGA_IN_BOARD_RESET- ), .D(USB_DATA_IN_BUS), .ENA(USB_DATA_IN), .PRN(1'b1), .Q(inst170_q));
  not inst368 (inst368_out, FPGA_OUT_sOUT);
  nor inst42 (inst42_out, inst288_out, \FPGA_OUT_pWR- , \PORT_7- );
  nor inst528 (inst528_out, inst526_out, \FPGA_OUT_pWR- , \PORT_7- );
  nor inst165 (inst165_out, inst338_out, \FPGA_OUT_pWR- , \PORT_7- );
  not inst322 (S100_PHANTOM_LED, FPGA_OUT_PHANTOM);
  nor inst392 (inst392_out, \FPGA_OUT_pWR- , \PORT_SELECT_68- , inst396_out);
  nor inst398 (inst398_out, \FPGA_OUT_pWR- , \PORT_SELECT_6A- , inst399_out);
  \74373  inst115 (
    .D1(Z80_ADDRESS[0]), .D3(Z80_ADDRESS[2]), .D6(Z80_ADDRESS[5]), .D7(Z80_ADDRESS[6]), .D2(Z80_ADDRESS[1]),
    .G(ADDRESS_LATCH), .D4(Z80_ADDRESS[3]), .D5(Z80_ADDRESS[4]), .D8(Z80_ADDRESS[7]), .OEN(inst177_out),
    .Q3(FPGA_OUT_A2), .Q6(FPGA_OUT_A5), .Q7(FPGA_OUT_A6), .Q2(FPGA_OUT_A1), .Q8(FPGA_OUT_A7),
    .Q4(FPGA_OUT_A3), .Q5(FPGA_OUT_A4), .Q1(FPGA_OUT_A0));
  \74373  inst116 (
    .D1(Z80_ADDRESS[8]), .D3(Z80_ADDRESS[10]), .D6(Z80_ADDRESS[13]), .D7(Z80_ADDRESS[14]),
    .D2(Z80_ADDRESS[9]), .G(ADDRESS_LATCH), .D4(Z80_ADDRESS[11]), .D5(Z80_ADDRESS[12]), .D8(Z80_ADDRESS[15]),
    .OEN(inst177_out), .Q3(inst116_q3), .Q6(inst116_q6), .Q7(inst116_q7), .Q2(inst116_q2), .Q8(inst116_q8),
    .Q4(inst116_q4), .Q5(inst116_q5), .Q1(inst116_q1));
  \74373  inst117 (
    .D1(1'b0), .D3(1'b0), .D6(1'b0), .D7(1'b0), .D2(1'b0), .G(ADDRESS_LATCH), .D4(1'b0), .D5(1'b0),
    .D8(1'b0), .OEN(inst177_out), .Q3(FPGA_OUT_A18), .Q2(FPGA_OUT_A17), .Q4(FPGA_OUT_A19), .Q1(FPGA_OUT_A16));  // open: Q6, Q7, Q8, Q5
  nand inst13 (ADDRESS_LATCH, FPGA_OUT_CPU_CLK, pSYNC_RAW);
  TRI inst79[7:0] (.IN(inst44_q), .OE(ROM_OE), .OUT(Z80_LOCAL_DI));
  not inst289 (inst289_out, IO_OUTPUT);
  not inst22 (USB_RX_BUSY_LED, UART_Byte_Recieved);
  nor inst367 (inst367_out, \FPGA_OUT_pWR- , inst368_out, \PORT_0- );
  nor inst43 (inst43_out, inst273_out, \FPGA_OUT_pWR- , \PORT_7- );
  and inst455 (\BOARD_INT- , inst458_out, \S100_INT- );
  and inst99 (\FPGA_OUT_RAM_OE- , \OUT_RAM_READ- , \FPGA_OUT_RAM_WR- );
  TRI inst133[7:0] (.IN(1'b0), .OE(JMP_ENABLE), .OUT(Z80_LOCAL_DI));
  nor inst147 (inst147_out, inst289_out, \IOBYTE- );
  TRI inst159[7:0] (.IN(inst170_q), .OE(USB_DATA_IN), .OUT(Z80_LOCAL_DI));
  and inst364 (inst364_out, \FPGA_IN_BOARD_RESET- , STOP_BUZZER);
  DFF inst274 (.CLRN(\FPGA_IN_BOARD_RESET- ), .CLK(inst42_out), .D(Z80_LOCAL_D0[0]), .PRN(1'b1), .Q(ROM_A12));
  DFF inst514 (.CLRN(\FPGA_IN_BOARD_RESET- ), .CLK(inst528_out), .D(Z80_LOCAL_D0[2]), .PRN(1'b1), .Q(ROM_A13));
  DFF inst336 (.CLRN(\FPGA_IN_BOARD_RESET- ), .CLK(inst165_out), .D(Z80_LOCAL_D0[7]), .PRN(1'b1), .Q(inst336_q));
  \74244  inst452 (
    .\1A2 (1'b0), .\1A4 (inst453_out), .\1A1 (1'b0), .\1A3 (1'b0), .\1GN (\INTA_READ_DATA- ), .\2A3 (1'b0),
    .\2GN (\INTA_READ_DATA- ), .\2A1 (inst457_out), .\2A4 (1'b0), .\2A2 (inst462_out),
    .\1Y2 (Z80_LOCAL_DI[1]), .\1Y4 (Z80_LOCAL_DI[3]), .\2Y1 (Z80_LOCAL_DI[4]), .\1Y1 (Z80_LOCAL_DI[0]),
    .\2Y3 (Z80_LOCAL_DI[6]), .\2Y4 (Z80_LOCAL_DI[7]), .\1Y3 (Z80_LOCAL_DI[2]), .\2Y2 (Z80_LOCAL_DI[5]));
  not inst41 (READ_RAM, \OUT_RAM_READ- );
  not inst17 (inst17_out, FPGA_OUT_pDBIN);
  DFF inst266 (.CLRN(\FPGA_IN_BOARD_RESET- ), .CLK(inst147_out), .D(Z80_LOCAL_D0[0]), .PRN(1'b1), .Q(inst266_q));
  DFF inst272 (.CLRN(\FPGA_IN_BOARD_RESET- ), .CLK(inst43_out), .D(Z80_LOCAL_D0[1]), .PRN(1'b1), .Q(DISABLE_ALL_ROM));
  not inst342 (\FORCE_LOW_SPEED- , inst336_q);
  DLATCH inst243[7:0] (.CLRN(\FPGA_IN_BOARD_RESET- ), .D(Z80_LOCAL_D0), .ENA(inst246_out), .PRN(1'b1), .Q(ocrx));
  DLATCH inst253[7:0] (.CLRN(\FPGA_IN_BOARD_RESET- ), .D(Z80_LOCAL_D0), .ENA(inst258_out), .PRN(1'b1), .Q(ocry));
  DLATCH inst325[2:0] (
    .CLRN(\FPGA_IN_BOARD_RESET- ), .D(Z80_LOCAL_D0[2:0]), .ENA(inst328_out), .PRN(1'b1), .Q(CTL[2:0]));
  not inst380 (inst380_out, SPI_BUSY_FLAG);
  not inst85 (inst85_out, ADDRESS_LATCH);
  nor inst2 (WRITE_RAM, \FPGA_OUT_RAM_WR- , JMP_ENABLE);
  \74165  inst121 (
    .D(1'b1), .C(1'b1), .B(1'b1), .G(1'b1), .H(1'b1), .A(1'b1), .CLKIH(1'b0), .E(1'b1), .F(1'b1),
    .CLK(FPGA_OUT_CPU_CLK), .STLD(inst285_out), .SER(1'b1), .QHN(inst121_qhn));  // open: QH
  nor inst164 (USB_DATA_OUT, \FPGA_OUT_pWR- , \USB_DATA- );
  or inst193 (UART_Busy, UART_Busy_Transmitting, UART_Busy_Transmitting);
  DFF inst345 (.CLRN(inst364_out), .CLK(inst367_out), .D(1'b1), .PRN(1'b1), .Q(START_BUZZER));
  or inst529 (inst529_out, ROM_A12, ROM_A13);
  assign inst259_out = {8{1'b0}} | {8{1'b0}};  // OR2 inst259, 8 bits wide
  not inst303 (inst303_out, FPGA_OUT_pDBIN);
  nand inst302 (inst302_out, VGA_RAM_SELECT, FPGA_OUT_sMEMR);
  not inst360 (inst360_out, \PORT_C7H- );
  DFF inst143 (.CLRN(FPGA_IN_PRN_ACK), .CLK(\FPGA_IN_BOARD_RESET- ), .D(1'b1), .PRN(inst365_out), .Q(PRN_ACK_LED));
  not inst78 (inst78_out, inst85_out);
  TRI inst135 (.IN(FPGA_BI_D2), .OE(READ_RAM), .OUT(Z80_LOCAL_DI[2]));
  TRI inst134 (.IN(FPGA_OUT_DO2), .OE(WRITE_RAM), .OUT(FPGA_BI_D2));
  TRI inst151 (.IN(FPGA_BI_D6), .OE(READ_RAM), .OUT(Z80_LOCAL_DI[6]));
  TRI inst150 (.IN(FPGA_OUT_DO6), .OE(WRITE_RAM), .OUT(FPGA_BI_D6));
  or inst6 (\IOBYTE_OE- , inst17_out, \IOBYTE- );
  nor inst369 (inst369_out, \FPGA_OUT_pWR- , \PORT_SELECT_6B- );
  and inst381 (inst381_out, inst380_out, \FPGA_IN_BOARD_RESET- );
  nor inst467 (inst467_out, \FPGA_OUT_pWR- , \PORT_SELECT_6E- );
  not inst177 (inst177_out, \FPGA_IN_SDSB- );
  not inst118 (inst118_out, inst78_out);
  not inst267 (inst267_out, FPGA_OUT_A15);
  not inst15 (USB_TX_BUSY_LED, UART_Busy);
  not inst344 (BUZZER, START_BUZZER);
  not inst329 (inst329_out, inst529_out);
  or inst9 (\FPGA_OUT_LOW_ROM_LED- , DISABLE_ALL_ROM, inst529_out);
  not inst352 (inst352_out, FPGA_OUT_pDBIN);
  nor inst294 (VGA_RAM_READ_DATA, inst303_out, inst302_out);
  nand inst359 (\PRINTER_STATUS_PORT- , FPGA_OUT_pDBIN, FPGA_OUT_sINP, inst360_out);
  DLATCH inst422 (
    .CLRN(\FPGA_IN_BOARD_RESET- ), .D(Z80_LOCAL_D0[7]), .ENA(inst392_out), .PRN(1'b1), .Q(SPI_DATA_OUT_BUS[7]));
  DLATCH inst423 (
    .CLRN(\FPGA_IN_BOARD_RESET- ), .D(Z80_LOCAL_D0[6]), .ENA(inst392_out), .PRN(1'b1), .Q(SPI_DATA_OUT_BUS[6]));
  DLATCH inst424 (
    .CLRN(\FPGA_IN_BOARD_RESET- ), .D(Z80_LOCAL_D0[5]), .ENA(inst392_out), .PRN(1'b1), .Q(SPI_DATA_OUT_BUS[5]));
  DLATCH inst425 (
    .CLRN(\FPGA_IN_BOARD_RESET- ), .D(Z80_LOCAL_D0[4]), .ENA(inst392_out), .PRN(1'b1), .Q(SPI_DATA_OUT_BUS[4]));
  DLATCH inst426 (
    .CLRN(\FPGA_IN_BOARD_RESET- ), .D(Z80_LOCAL_D0[3]), .ENA(inst392_out), .PRN(1'b1), .Q(SPI_DATA_OUT_BUS[3]));
  DLATCH inst427 (
    .CLRN(\FPGA_IN_BOARD_RESET- ), .D(Z80_LOCAL_D0[2]), .ENA(inst392_out), .PRN(1'b1), .Q(SPI_DATA_OUT_BUS[2]));
  DLATCH inst428 (
    .CLRN(\FPGA_IN_BOARD_RESET- ), .D(Z80_LOCAL_D0[1]), .ENA(inst392_out), .PRN(1'b1), .Q(SPI_DATA_OUT_BUS[1]));
  DLATCH inst429 (
    .CLRN(\FPGA_IN_BOARD_RESET- ), .D(Z80_LOCAL_D0[0]), .ENA(inst392_out), .PRN(1'b1), .Q(SPI_DATA_OUT_BUS[0]));
  DLATCH inst397 (.CLRN(\FPGA_IN_BOARD_RESET- ), .D(Z80_LOCAL_D0[0]), .ENA(inst398_out), .PRN(1'b1), .Q(RTC_CS));
  nor inst300 (inst300_out, \FPGA_OUT_pWR- , \PORT_SELECT_6C- );
  nor inst465 (inst465_out, \FPGA_OUT_pWR- , \PORT_SELECT_6D- );
  nor inst19 (\BOARD_WAIT- , inst103_qhn, inst121_qhn, inst121_qhn);
  \74373  inst18 (
    .D1(DIP7), .D3(DIP5), .D6(DIP2), .D7(DIP1), .D2(DIP6), .G(inst17_out), .D4(DIP4), .D5(DIP3), .D8(DIP0),
    .OEN(\IOBYTE_OE- ), .Q3(Z80_LOCAL_DI[2]), .Q6(Z80_LOCAL_DI[5]), .Q7(Z80_LOCAL_DI[6]),
    .Q2(Z80_LOCAL_DI[1]), .Q8(Z80_LOCAL_DI[7]), .Q4(Z80_LOCAL_DI[3]), .Q5(Z80_LOCAL_DI[4]),
    .Q1(Z80_LOCAL_DI[0]));
  not inst270 (\FPGA_OUT_HIGH_RAM_LED- , inst266_q);
  and inst268 (FPGA_OUT_RAM_A16, inst266_q, inst267_out);
  or inst14 (\FPGA_OUT_HIGH_ROM_LED- , DISABLE_ALL_ROM, inst329_out);
  DFF inst377 (.CLRN(inst381_out), .CLK(inst369_out), .D(1'b1), .PRN(1'b1), .Q(inst377_q));
  DFF inst292 (.CLRN(1'b1), .CLK(OUT_CPU_CLK), .D(\FPGA_IN_pHOLD- ), .PRN(1'b1), .Q(\Z80_BUSRQ- ));
  not inst113 (FPGA_OUT_pHLDA, \Z80_BUSAK- );
  or inst310 (ROM_ADDRESS[0], FPGA_OUT_A0, FPGA_OUT_A0);
  or inst309 (ROM_ADDRESS[1], FPGA_OUT_A1, FPGA_OUT_A1);
  or inst308 (ROM_ADDRESS[2], FPGA_OUT_A2, FPGA_OUT_A2);
  or inst307 (ROM_ADDRESS[3], FPGA_OUT_A3, FPGA_OUT_A3);
  or inst306 (ROM_ADDRESS[4], FPGA_OUT_A4, FPGA_OUT_A4);
  or inst305 (ROM_ADDRESS[5], FPGA_OUT_A5, FPGA_OUT_A5);
  or inst316 (ROM_ADDRESS[6], FPGA_OUT_A6, FPGA_OUT_A6);
  DFF inst349 (.CLRN(inst364_out), .CLK(COUNTER_BUS[16]), .D(START_BUZZER), .PRN(1'b1), .Q(inst349_q));
  nor inst353 (PS2_STATUS_IN, inst352_out, \PS2_STATUS- );
  Two_Port_RAM inst271 (
    .data_a(Z80_LOCAL_D0), .address_a(LOCAL_ADDRESS_BUS[11:0]), .wren_a(VGA_RAM_WRITE_DATA),
    .data_b(inst259_out), .address_b(TEXT_A), .wren_b(1'b0), .clock_a(\25Mhz ), .clock_b(\25Mhz ),
    .q_a(inst271_q_a), .q_b(RAM_TEXT_D));
  not inst62 (inst62_out, FPGA_OUT_pDBIN);
  not inst236 (inst236_out, FPGA_OUT_pDBIN);
  DFF inst97 (.CLRN(inst29_out), .CLK(inst118_out), .D(inst29_out), .PRN(1'b1), .Q(inst97_q));
  FPGA_ROM inst240 (.address(FONT_A), .clock(\25Mhz ), .q(FONT_D));
  not inst330 (inst330_out, FPGA_OUT_pDBIN);
  not inst525 (inst525_out, P33);
  not inst241 (IN_BOARD_RESET, \FPGA_IN_BOARD_RESET- );
  DFF inst108 (.CLRN(FPGA_OUT_pHLDA), .CLK(FPGA_OUT_CPU_CLK), .D(FPGA_OUT_pHLDA), .PRN(1'b1), .Q(inst108_q));
  DLATCH inst158[7:0] (
    .CLRN(\FPGA_IN_BOARD_RESET- ), .D(Z80_LOCAL_D0), .ENA(USB_DATA_OUT), .PRN(1'b1), .Q(USB_DATA_OUT_BUS));
  or inst77 (inst77_out, inst62_out, \PORT_C0H- );
  or inst142 (inst142_out, inst236_out, \PORT_C1H- );
  or inst232 (inst232_out, inst330_out, \PORT_C2H- );
  not inst323 (\VGA_RAM_READ_DATA- , VGA_RAM_READ_DATA);
  DFF inst379 (.CLRN(inst381_out), .CLK(SPI_CLK), .D(inst377_q), .PRN(1'b1), .Q(SPI_WRITE));
  not inst87 (\FPGA_OUT_CTL_OE- , \FPGA_IN_CDSB- );
  not inst88 (\FPGA_OUT_STATUS_OE- , \FPGA_IN_SDSB- );
  not inst100 (\FPGA_ADD_OE- , \FPGA_IN_SDSB- );
  not inst101 (\FPGA_OUT_DO_OE- , \FPGA_IN_SDSB- );
  not inst107 (\FPGA_OUT_DI_OE- , \FPGA_IN_SDSB- );
  DFF inst358 (.CLRN(inst364_out), .CLK(COUNTER_BUS[16]), .D(inst349_q), .PRN(1'b1), .Q(inst358_q));
  nor inst523 (inst523_out, \FPGA_OUT_pWR- , \PORT_SELECT_6F- );
  and inst507 (inst507_out, inst525_out, \FPGA_IN_BOARD_RESET- );
  \74373b  inst280 (.D(Z80_ADDRESS[7:0]), .G(ADDRESS_LATCH), .OEN(inst281_out), .Q(LOCAL_ADDRESS_BUS[7:0]));
  \74373b  inst282 (.D(Z80_ADDRESS[15:8]), .G(ADDRESS_LATCH), .OEN(inst283_out), .Q(LOCAL_ADDRESS_BUS[15:8]));
  not inst291 (inst291_out, inst108_q);
  not inst362 (STOP_BUZZER, inst358_q);
  not inst187 (inst187_out, FPGA_OUT_sOUT);
  DLATCH inst351 (
    .CLRN(\FPGA_IN_BOARD_RESET- ), .D(PS2_KEYBOARD_STATUS), .ENA(PS2_STATUS_IN), .PRN(1'b1), .Q(inst351_q));
  \74373b  inst260 (.D(CURSOR_X), .G(inst62_out), .OEN(inst77_out), .Q(Z80_LOCAL_DI));
  \74373b  inst261 (.D(CURSOR_Y), .G(inst236_out), .OEN(inst142_out), .Q(Z80_LOCAL_DI));
  nor inst109 (inst109_out, \FPGA_IN_pHOLD- , inst291_out);
  TRI inst213[7:0] (.IN(inst271_q_a), .OE(VGA_RAM_READ_DATA), .OUT(Z80_LOCAL_DI));
  \74373b  inst331 (.D(CURSOR_Y), .G(inst330_out), .OEN(inst232_out), .Q(Z80_LOCAL_DI));
  \74244  inst335 (
    .\1A2 (FPGA_IN_PRN_BUSY), .\1A4 (1'b1), .\1A1 (PRN_ACK_LED), .\1A3 (1'b1),
    .\1GN (\PRINTER_STATUS_PORT- ), .\2A3 (1'b1), .\2GN (\PRINTER_STATUS_PORT- ), .\2A1 (1'b1), .\2A4 (1'b1),
    .\2A2 (1'b1), .\1Y2 (Z80_LOCAL_DI[1]), .\1Y4 (Z80_LOCAL_DI[3]), .\2Y1 (Z80_LOCAL_DI[4]),
    .\1Y1 (Z80_LOCAL_DI[0]), .\2Y3 (Z80_LOCAL_DI[6]), .\2Y4 (Z80_LOCAL_DI[7]), .\1Y3 (Z80_LOCAL_DI[2]),
    .\2Y2 (Z80_LOCAL_DI[5]));
  DFF inst468 (.CLRN(inst507_out), .CLK(inst523_out), .D(1'b1), .PRN(1'b1), .Q(inst468_q));
  or inst315 (ROM_ADDRESS[7], FPGA_OUT_A7, FPGA_OUT_A7);
  or inst314 (ROM_ADDRESS[8], FPGA_OUT_A8, FPGA_OUT_A8);
  or inst313 (ROM_ADDRESS[9], FPGA_OUT_A9, FPGA_OUT_A9);
  or inst312 (ROM_ADDRESS[10], FPGA_OUT_A10, FPGA_OUT_A10);
  or inst311 (ROM_ADDRESS[11], FPGA_OUT_A11, FPGA_OUT_A11);
  or inst317 (ROM_ADDRESS[12], ROM_A12, ROM_A12);
  or inst513 (ROM_ADDRESS[13], ROM_A13, ROM_A13);
  nor inst218 (inst218_out, \FPGA_OUT_pWR- , inst187_out, \PORT_6- );
  TRI inst172 (.IN(inst351_q), .OE(PS2_STATUS_IN), .OUT(Z80_LOCAL_DI[0]));
  DLATCH inst495 (
    .CLRN(\FPGA_IN_BOARD_RESET- ), .D(Z80_LOCAL_D0[7]), .ENA(inst300_out), .PRN(1'b1), .Q(DATA_TO_SDCARD[7]));
  DLATCH inst496 (
    .CLRN(\FPGA_IN_BOARD_RESET- ), .D(Z80_LOCAL_D0[6]), .ENA(inst300_out), .PRN(1'b1), .Q(DATA_TO_SDCARD[6]));
  DLATCH inst497 (
    .CLRN(\FPGA_IN_BOARD_RESET- ), .D(Z80_LOCAL_D0[5]), .ENA(inst300_out), .PRN(1'b1), .Q(DATA_TO_SDCARD[5]));
  DLATCH inst498 (
    .CLRN(\FPGA_IN_BOARD_RESET- ), .D(Z80_LOCAL_D0[4]), .ENA(inst300_out), .PRN(1'b1), .Q(DATA_TO_SDCARD[4]));
  DLATCH inst499 (
    .CLRN(\FPGA_IN_BOARD_RESET- ), .D(Z80_LOCAL_D0[3]), .ENA(inst300_out), .PRN(1'b1), .Q(DATA_TO_SDCARD[3]));
  DLATCH inst500 (
    .CLRN(\FPGA_IN_BOARD_RESET- ), .D(Z80_LOCAL_D0[2]), .ENA(inst300_out), .PRN(1'b1), .Q(DATA_TO_SDCARD[2]));
  DLATCH inst501 (
    .CLRN(\FPGA_IN_BOARD_RESET- ), .D(Z80_LOCAL_D0[1]), .ENA(inst300_out), .PRN(1'b1), .Q(DATA_TO_SDCARD[1]));
  DLATCH inst502 (
    .CLRN(\FPGA_IN_BOARD_RESET- ), .D(Z80_LOCAL_D0[0]), .ENA(inst300_out), .PRN(1'b1), .Q(DATA_TO_SDCARD[0]));
  not inst281 (inst281_out, \FPGA_IN_SDSB- );
  not inst283 (inst283_out, \FPGA_IN_SDSB- );
  TRI inst137 (.IN(FPGA_BI_D3), .OE(READ_RAM), .OUT(Z80_LOCAL_DI[3]));
  TRI inst136 (.IN(FPGA_OUT_DO3), .OE(WRITE_RAM), .OUT(FPGA_BI_D3));
  not inst441 (inst441_out, FPGA_OUT_sOUT);
  DLATCH inst478 (.CLRN(\FPGA_IN_BOARD_RESET- ), .D(Z80_LOCAL_D0[0]), .ENA(inst465_out), .PRN(1'b1), .Q(DIAG_LED));
  DLATCH inst508 (.CLRN(1'b1), .D(Z80_LOCAL_D0[0]), .ENA(inst467_out), .PRN(\FPGA_IN_BOARD_RESET- ), .Q(LED_2));
  DLATCH inst509 (.CLRN(1'b1), .D(Z80_LOCAL_D0[1]), .ENA(inst467_out), .PRN(\FPGA_IN_BOARD_RESET- ), .Q(LED_3));
  DFF inst102 (.CLRN(1'b1), .CLK(OUT_CPU_CLK), .D(inst109_out), .PRN(1'b1), .Q(inst102_q));
  TRI inst156 (.IN(FPGA_BI_D7), .OE(READ_RAM), .OUT(Z80_LOCAL_DI[7]));
  TRI inst155 (.IN(FPGA_OUT_DO7), .OE(WRITE_RAM), .OUT(FPGA_BI_D7));
  not inst384 (inst384_out, FPGA_OUT_pDBIN);
  not inst390 (inst390_out, SPI_BUSY_FLAG);
  not inst86 (inst86_out, \FPGA_IN_CDSB- );
  nor inst370 (inst370_out, inst384_out, \PORT_SELECT_6B- );
  and inst391 (inst391_out, inst390_out, \FPGA_IN_BOARD_RESET- );
  nor inst440 (inst440_out, \FPGA_OUT_pWR- , \PORT_SELECT_69- , inst441_out);
  DFF inst506 (.CLRN(inst507_out), .CLK(FPGA_OUT_SPARE1), .D(inst468_q), .PRN(1'b1), .Q(P1));
  not inst110 (FPGA_OUT_CTL_DISABLE, inst102_q);
  \74244  inst71 (
    .\1A2 (pSYNC_RAW), .\1A4 (inst81_out), .\1A1 (inst97_q), .\1A3 (ADDRESS_LATCH), .\1GN (inst86_out),
    .\2A3 (inst83_out), .\2GN (inst84_out), .\2A1 (OUT_CPU_CLK), .\2A4 (\FPGA_IN_INT- ), .\2A2 (\2mHz ),
    .\1Y2 (FPGA_OUT_pSYNC), .\1Y4 (\FPGA_OUT_pWR- ), .\2Y1 (FPGA_OUT_PHI), .\1Y1 (FPGA_OUT_pDBIN),
    .\2Y3 (FPGA_OUT_MWRT), .\2Y4 (\S100_INT- ), .\1Y3 (\FPGA_OUT_pSTVAL- ), .\2Y2 (FPGA_OUT_2mHz_CLOCK));
  nor inst83 (inst83_out, IO_OUTPUT, inst81_out);
  DLATCH inst182 (.CLRN(\FPGA_IN_BOARD_RESET- ), .D(Z80_LOCAL_D0[0]), .ENA(inst218_out), .PRN(1'b1), .Q(inst182_q));
  DLATCH inst183 (.CLRN(\FPGA_IN_BOARD_RESET- ), .D(Z80_LOCAL_D0[1]), .ENA(inst218_out), .PRN(1'b1), .Q(inst183_q));
  DLATCH inst184 (.CLRN(\FPGA_IN_BOARD_RESET- ), .D(Z80_LOCAL_D0[2]), .ENA(inst218_out), .PRN(1'b1), .Q(inst184_q));
  DLATCH inst185 (.CLRN(\FPGA_IN_BOARD_RESET- ), .D(Z80_LOCAL_D0[3]), .ENA(inst218_out), .PRN(1'b1), .Q(inst185_q));
  DLATCH inst186 (.CLRN(\FPGA_IN_BOARD_RESET- ), .D(Z80_LOCAL_D0[4]), .ENA(inst218_out), .PRN(1'b1), .Q(inst186_q));
  DLATCH inst188 (.CLRN(\FPGA_IN_BOARD_RESET- ), .D(Z80_LOCAL_D0[5]), .ENA(inst218_out), .PRN(1'b1), .Q(inst188_q));
  DLATCH inst208 (.CLRN(\FPGA_IN_BOARD_RESET- ), .D(Z80_LOCAL_D0[6]), .ENA(inst218_out), .PRN(1'b1), .Q(inst208_q));
  DLATCH inst209 (.CLRN(\FPGA_IN_BOARD_RESET- ), .D(Z80_LOCAL_D0[7]), .ENA(inst218_out), .PRN(1'b1), .Q(inst209_q));
  and inst332 (\VGA_CURSOR_OE- , inst77_out, inst142_out, inst232_out);
  not inst112 (FPGA_OUT_STATUS_DISABLE, inst108_q);
  not inst191 (inst191_out, FPGA_OUT_pDBIN);
  DFF inst387 (.CLRN(inst391_out), .CLK(inst370_out), .D(1'b1), .PRN(1'b1), .Q(inst387_q));
  not inst212 (F_BAR0, inst182_q);
  not inst214 (F_BAR1, inst183_q);
  not inst215 (F_BAR2, inst184_q);
  nor inst205 (USB_STATUS_IN, inst191_out, \USB_STATUS- );
  not inst216 (F_BAR3, inst185_q);
  not inst219 (F_BAR4, inst186_q);
  not inst221 (F_BAR5, inst188_q);
  not inst220 (F_BAR6, inst208_q);
  not inst222 (F_BAR7, inst209_q);
  assign CURSOR_Y[7:6] = 2'b00 | 2'b00;  // OR2 inst238, 2 bits wide
  or inst237 (CURSOR_X[7], 1'b0, 1'b0);
  DFF inst389 (.CLRN(inst391_out), .CLK(SPI_CLK), .D(inst387_q), .PRN(1'b1), .Q(SPI_READ));
  not inst511 (inst511_out, FPGA_OUT_pDBIN);
  not inst521 (inst521_out, P33);
  nor inst524 (inst524_out, inst511_out, \PORT_SELECT_6F- );
  and inst522 (inst522_out, inst521_out, \FPGA_IN_BOARD_RESET- );
  DLATCH inst432 (
    .CLRN(\FPGA_IN_BOARD_RESET- ), .D(Z80_LOCAL_D0[7]), .ENA(inst440_out), .PRN(1'b1),
    .Q(SPI_DATA_OUT_BUS[15]));
  DLATCH inst433 (
    .CLRN(\FPGA_IN_BOARD_RESET- ), .D(Z80_LOCAL_D0[6]), .ENA(inst440_out), .PRN(1'b1),
    .Q(SPI_DATA_OUT_BUS[14]));
  DLATCH inst434 (
    .CLRN(\FPGA_IN_BOARD_RESET- ), .D(Z80_LOCAL_D0[5]), .ENA(inst440_out), .PRN(1'b1),
    .Q(SPI_DATA_OUT_BUS[13]));
  DLATCH inst435 (
    .CLRN(\FPGA_IN_BOARD_RESET- ), .D(Z80_LOCAL_D0[4]), .ENA(inst440_out), .PRN(1'b1),
    .Q(SPI_DATA_OUT_BUS[12]));
  DLATCH inst436 (
    .CLRN(\FPGA_IN_BOARD_RESET- ), .D(Z80_LOCAL_D0[3]), .ENA(inst440_out), .PRN(1'b1),
    .Q(SPI_DATA_OUT_BUS[11]));
  DLATCH inst437 (
    .CLRN(\FPGA_IN_BOARD_RESET- ), .D(Z80_LOCAL_D0[2]), .ENA(inst440_out), .PRN(1'b1),
    .Q(SPI_DATA_OUT_BUS[10]));
  DLATCH inst438 (
    .CLRN(\FPGA_IN_BOARD_RESET- ), .D(Z80_LOCAL_D0[1]), .ENA(inst440_out), .PRN(1'b1), .Q(SPI_DATA_OUT_BUS[9]));
  DLATCH inst439 (
    .CLRN(\FPGA_IN_BOARD_RESET- ), .D(Z80_LOCAL_D0[0]), .ENA(inst440_out), .PRN(1'b1), .Q(SPI_DATA_OUT_BUS[8]));
  not inst491 (inst491_out, \PORT_SELECT_6C- );
  not inst492 (inst492_out, \PORT_SELECT_6E- );
  DFF inst512 (.CLRN(inst522_out), .CLK(inst524_out), .D(1'b1), .PRN(1'b1), .Q(inst512_q));
  and inst474 (inst474_out, FPGA_OUT_pDBIN, inst492_out);
  not inst206 (\USB_STATUS_IN- , USB_STATUS_IN);
  and inst473 (inst473_out, FPGA_OUT_pDBIN, inst491_out);
  DLATCH inst194 (.CLRN(\FPGA_IN_BOARD_RESET- ), .D(UART_DATA_READY), .ENA(USB_STATUS_IN), .PRN(1'b1), .Q(inst194_q));
  DLATCH inst195 (.CLRN(\FPGA_IN_BOARD_RESET- ), .D(UART_Busy), .ENA(USB_STATUS_IN), .PRN(1'b1), .Q(inst195_q));
  DLATCH inst196 (
    .CLRN(\FPGA_IN_BOARD_RESET- ), .D(UART_Byte_Recieved), .ENA(USB_STATUS_IN), .PRN(1'b1), .Q(inst196_q));
  DLATCH inst197 (
    .CLRN(\FPGA_IN_BOARD_RESET- ), .D(UART_Busy_Recieving), .ENA(USB_STATUS_IN), .PRN(1'b1), .Q(inst197_q));
  DLATCH inst198 (.CLRN(\FPGA_IN_BOARD_RESET- ), .D(1'b0), .ENA(USB_STATUS_IN), .PRN(1'b1), .Q(inst198_q));
  DLATCH inst199 (.CLRN(\FPGA_IN_BOARD_RESET- ), .D(1'b0), .ENA(USB_STATUS_IN), .PRN(1'b1), .Q(inst199_q));
  DLATCH inst200 (.CLRN(\FPGA_IN_BOARD_RESET- ), .D(1'b0), .ENA(USB_STATUS_IN), .PRN(1'b1), .Q(inst200_q));
  DLATCH inst201 (.CLRN(\FPGA_IN_BOARD_RESET- ), .D(UART_Error), .ENA(USB_STATUS_IN), .PRN(1'b1), .Q(inst201_q));
  \74244  inst252 (
    .\1A2 (inst183_q), .\1A4 (inst185_q), .\1A1 (inst182_q), .\1A3 (inst184_q), .\1GN (\BAR_IN_ENABLE- ),
    .\2A3 (inst208_q), .\2GN (\BAR_IN_ENABLE- ), .\2A1 (inst186_q), .\2A4 (inst209_q), .\2A2 (inst188_q),
    .\1Y2 (Z80_LOCAL_DI[1]), .\1Y4 (Z80_LOCAL_DI[3]), .\2Y1 (Z80_LOCAL_DI[4]), .\1Y1 (Z80_LOCAL_DI[0]),
    .\2Y3 (Z80_LOCAL_DI[6]), .\2Y4 (Z80_LOCAL_DI[7]), .\1Y3 (Z80_LOCAL_DI[2]), .\2Y2 (Z80_LOCAL_DI[5]));
  DFF inst517 (.CLRN(inst522_out), .CLK(FPGA_OUT_SPARE1), .D(inst512_q), .PRN(1'b1), .Q(P17));
  nor inst470 (\SD_CARD_READ_DATA- , inst474_out, inst473_out);
  not inst254 (inst254_out, \PORT_6- );
  nand inst256 (\BAR_IN_ENABLE- , FPGA_OUT_pDBIN, FPGA_OUT_sINP, inst254_out);
  DLATCH inst482 (
    .CLRN(\FPGA_IN_BOARD_RESET- ), .D(DATA_FROM_SDCARD[7]), .ENA(inst473_out), .PRN(1'b1), .Q(SDCARD_OUT_7));
  DLATCH inst483 (
    .CLRN(\FPGA_IN_BOARD_RESET- ), .D(DATA_FROM_SDCARD[6]), .ENA(inst473_out), .PRN(1'b1), .Q(SDCARD_OUT_6));
  DLATCH inst484 (
    .CLRN(\FPGA_IN_BOARD_RESET- ), .D(DATA_FROM_SDCARD[5]), .ENA(inst473_out), .PRN(1'b1), .Q(SDCARD_OUT_5));
  DLATCH inst485 (
    .CLRN(\FPGA_IN_BOARD_RESET- ), .D(DATA_FROM_SDCARD[4]), .ENA(inst473_out), .PRN(1'b1), .Q(SDCARD_OUT_4));
  DLATCH inst486 (
    .CLRN(\FPGA_IN_BOARD_RESET- ), .D(DATA_FROM_SDCARD[3]), .ENA(inst473_out), .PRN(1'b1), .Q(SDCARD_OUT_3));
  DLATCH inst487 (
    .CLRN(\FPGA_IN_BOARD_RESET- ), .D(DATA_FROM_SDCARD[2]), .ENA(inst473_out), .PRN(1'b1), .Q(SDCARD_OUT_2));
  DLATCH inst488 (
    .CLRN(\FPGA_IN_BOARD_RESET- ), .D(DATA_FROM_SDCARD[1]), .ENA(inst473_out), .PRN(1'b1), .Q(SDCARD_OUT_1));
  DLATCH inst489 (
    .CLRN(\FPGA_IN_BOARD_RESET- ), .D(DATA_FROM_SDCARD[0]), .ENA(inst473_out), .PRN(1'b1), .Q(SDCARD_OUT_0));
  DLATCH inst471 (.CLRN(\FPGA_IN_BOARD_RESET- ), .D(P33), .ENA(inst474_out), .PRN(1'b1), .Q(inst471_q));
  DLATCH inst476 (.CLRN(\FPGA_IN_BOARD_RESET- ), .D(LED_2), .ENA(inst474_out), .PRN(1'b1), .Q(inst476_q));
  DLATCH inst480 (.CLRN(\FPGA_IN_BOARD_RESET- ), .D(LED_3), .ENA(inst474_out), .PRN(1'b1), .Q(inst480_q));
  not inst493 (inst493_out, inst473_out);
  not inst475 (inst475_out, inst474_out);
  not inst419 (inst419_out, \PORT_SELECT_6A- );
  \74244  inst469 (
    .\1A2 (SDCARD_OUT_6), .\1A4 (SDCARD_OUT_4), .\1A1 (SDCARD_OUT_7), .\1A3 (SDCARD_OUT_5),
    .\1GN (inst493_out), .\2A3 (SDCARD_OUT_1), .\2GN (inst493_out), .\2A1 (SDCARD_OUT_3),
    .\2A4 (SDCARD_OUT_0), .\2A2 (SDCARD_OUT_2), .\1Y2 (Z80_LOCAL_DI[6]), .\1Y4 (Z80_LOCAL_DI[4]),
    .\2Y1 (Z80_LOCAL_DI[3]), .\1Y1 (Z80_LOCAL_DI[7]), .\2Y3 (Z80_LOCAL_DI[1]), .\2Y4 (Z80_LOCAL_DI[0]),
    .\1Y3 (Z80_LOCAL_DI[5]), .\2Y2 (Z80_LOCAL_DI[2]));
  \74244  inst255 (
    .\1A2 (inst195_q), .\1A4 (inst197_q), .\1A1 (inst194_q), .\1A3 (inst196_q), .\1GN (\USB_STATUS_IN- ),
    .\2A3 (inst200_q), .\2GN (\USB_STATUS_IN- ), .\2A1 (inst198_q), .\2A4 (inst201_q), .\2A2 (inst199_q),
    .\1Y2 (Z80_LOCAL_DI[1]), .\1Y4 (Z80_LOCAL_DI[3]), .\2Y1 (Z80_LOCAL_DI[4]), .\1Y1 (Z80_LOCAL_DI[0]),
    .\2Y3 (Z80_LOCAL_DI[6]), .\2Y4 (Z80_LOCAL_DI[7]), .\1Y3 (Z80_LOCAL_DI[2]), .\2Y2 (Z80_LOCAL_DI[5]));
  not inst415 (inst415_out, \PORT_SELECT_69- );
  and inst418 (inst418_out, FPGA_OUT_pDBIN, inst419_out, FPGA_OUT_sINP);
